# EAGLE design OMHGW_3_2 (EAGLE 5.11)
VERSION: OMHGM_3_2

## Sheet 1 of 3
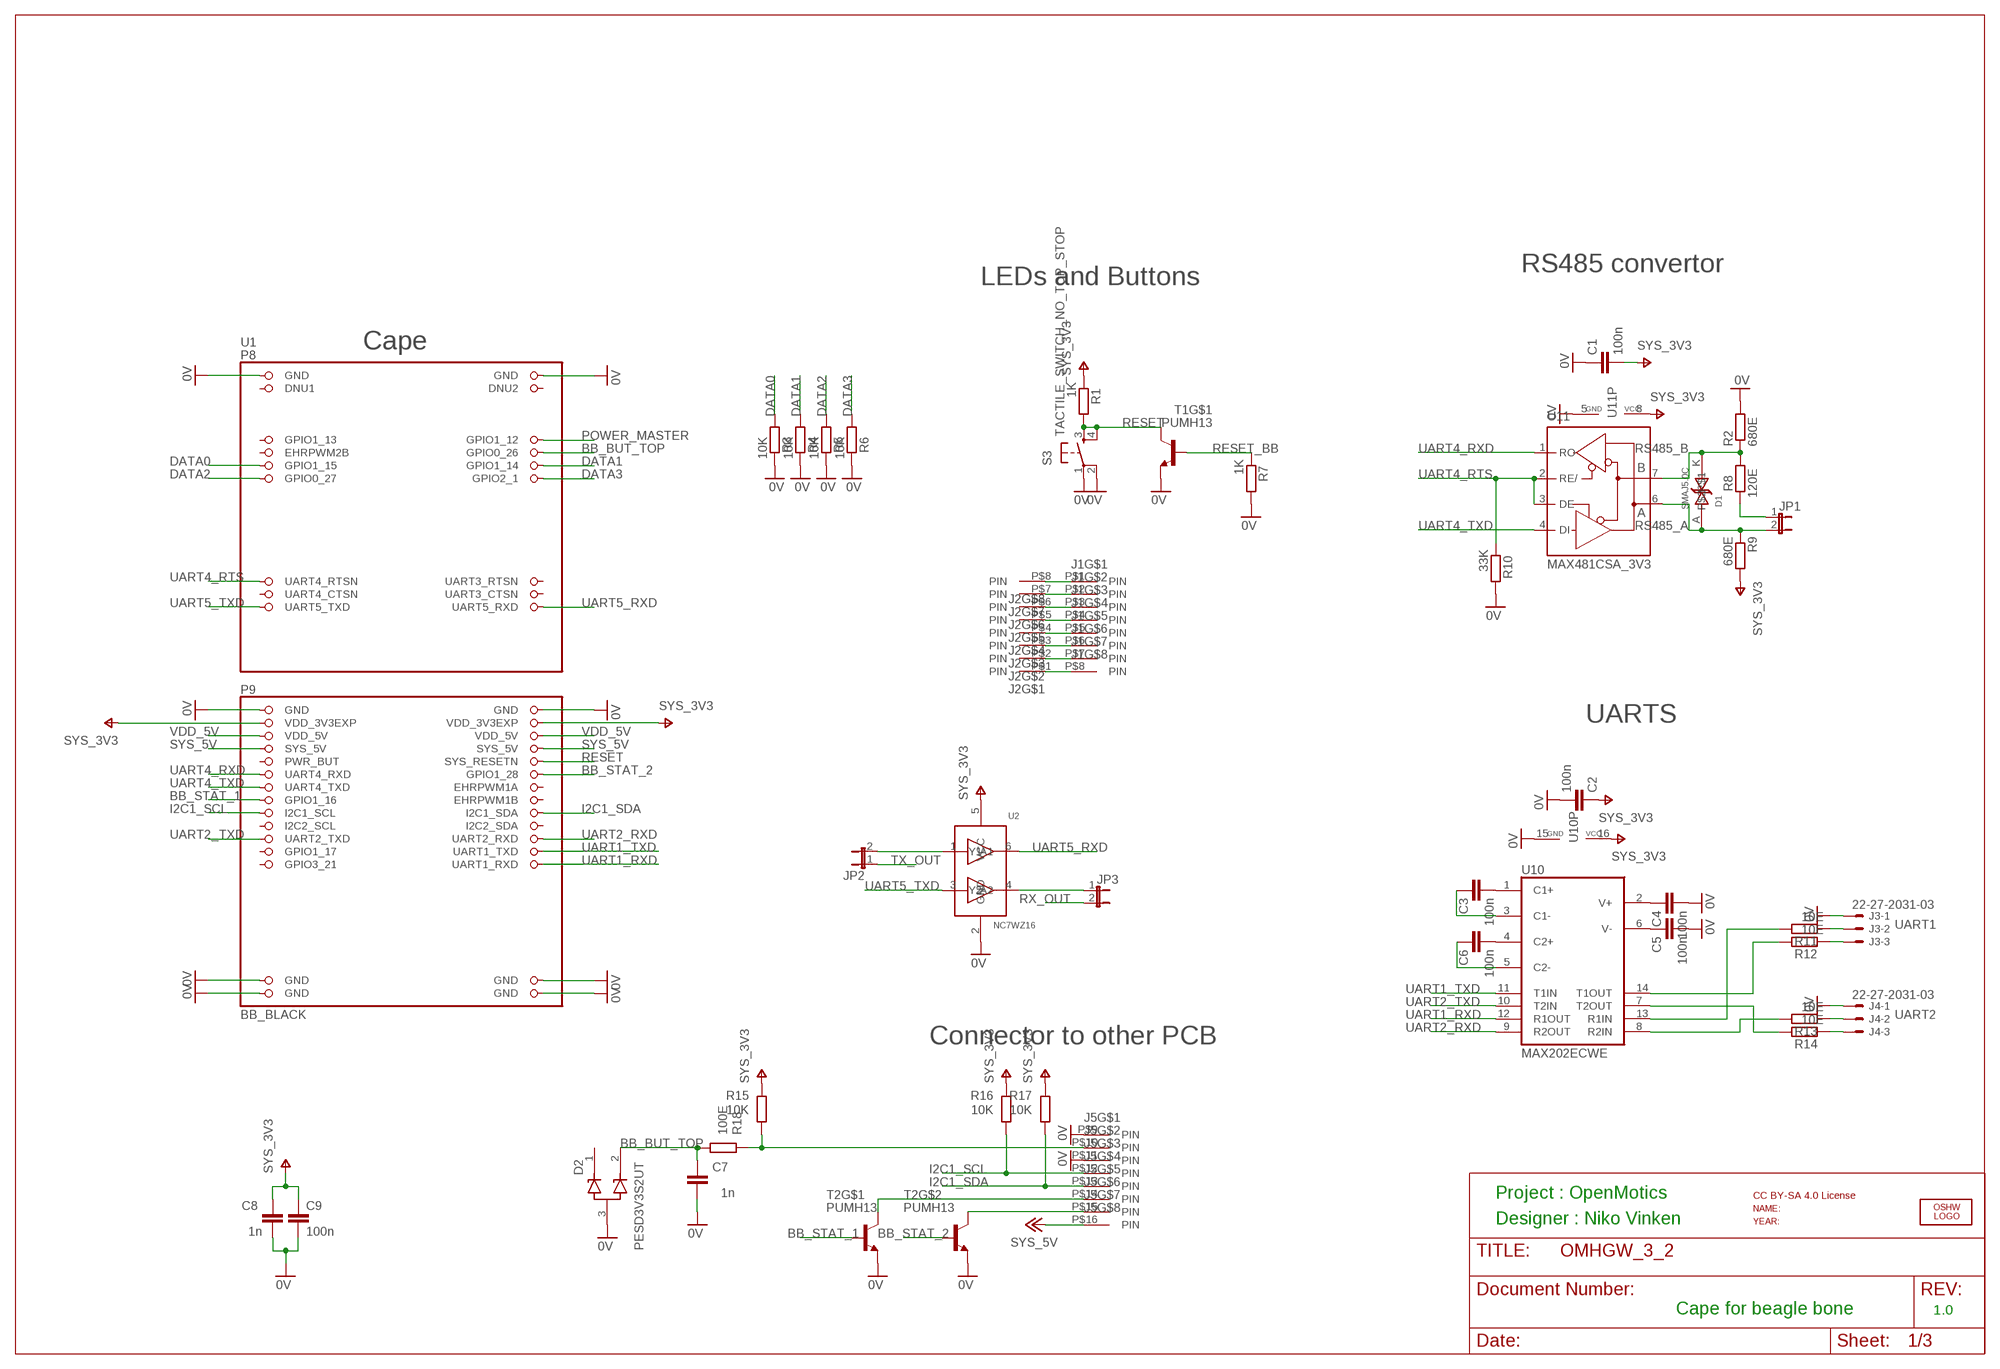
[diagram p0: schematic, sheet 1]

### Parts
C1  100n  C-EUC0603  [C0603]
C2  100n  C-EUC0603  [C0603]
C3  100n  C-EUC0603  [C0603]
C4  100n  C-EUC0603  [C0603]
C5  100n  C-EUC0603  [C0603]
C6  100n  C-EUC0603  [C0603]
C7  1n  C-EUC0603  [C0603]
C8  1n  C-EUC0603  [C0603]
C9  100n  C-EUC0603  [C0603]
D1  SMAJ5.0C  [DO-214AC(SMA)]
D2  PESD3V3S2UT  PESD3V3S2UAT  [SOT23]
J1  TM23_RJ45  [TM23_RJ45]
J2  98414-G06-08ULF  [98414-G06-08ULF]
J3  22-27-2031-03  [6410-03]
J4  22-27-2031-03  [6410-03]
J5  8PIN_CON_AMPSMD  [8PIN_CON_AMP_SMD]
JP1  JP1E  [JP1]
JP2  JP1E  [JP1]
JP3  JP1E  [JP1]
LOGO2  OSHW_LOGO_FILLX0150-NT  [OSHW_FILLX150_NOTEXT]
R1  1K  R-EU_R0603  [R0603]
R2  680E  R-EU_R0603  [R0603]
R3  10K  R-EU_R0603  [R0603]
R4  10K  R-EU_R0603  [R0603]
R5  10K  R-EU_R0603  [R0603]
R6  10K  R-EU_R0603  [R0603]
R7  1K  R-EU_R0603  [R0603]
R8  120E  R-EU_R0603  [R0603]
R9  680E  R-EU_R0603  [R0603]
R10  33K  R-EU_R0603  [R0603]
R11  10E  R-EU_R0603  [R0603]
R12  10E  R-EU_R0603  [R0603]
R13  10E  R-EU_R0603  [R0603]
R14  10E  R-EU_R0603  [R0603]
R15  10K  R-EU_R0603  [R0603]
R16  10K  R-EU_R0603  [R0603]
R17  10K  R-EU_R0603  [R0603]
R18  100E  R-EU_R0603  [R0603]
S3  TACTILE_SWITCH_NO_TOP_STOP  [B3F_10XX]
T1  PUMH13  [SOT363]
T2  PUMH13  [SOT363]
U1  BB_BLACK  [BB_BLACK_PINS]
U2  NC7WZ16  [SC70_6P]
U10  MAX202ECWE  [SOIC18]
U11  MAX481CSA_3V3  MAX481CSA  [SO08]
U$5  CC_BY_SA  [CC_BY_SA]

### Nets
0V: C1.1 C2.2 C4.2 C5.2 C7.1 C8.2 C9.2 D2.3 J3.1 J4.1 J5.P$9 J5.P$11 R2.2 R3.1 R4.1 R5.1 R6.1 R7.2 R10.2 S3.1(P) S3.2(P1) T1.1(E) T2.1(E) T2.4(E) U1.P$1(GND) U1.P$2(GND) U1.P$43(GND) U1.P$44(GND) U1.P$45(GND) U1.P$46(GND) U1.P$47(GND) U1.P$48(GND) U2.2(GND) U10.15(GND) U11.5(GND) ; also sheet 2,3
BB_BUT_TOP: C7.2 D2.2 R18.1 U1.P$60(GPIO0_26)
BB_STAT_1: T2.2(B) U1.P$15(GPIO1_16)
BB_STAT_2: T2.5(B) U1.P$12(GPIO1_28)
DATA0: R3.2 U1.P$61(GPIO1_15) ; also sheet 2
DATA1: R4.2 U1.P$62(GPIO1_14) ; also sheet 2
DATA2: R5.2 U1.P$63(GPIO0_27) ; also sheet 2
DATA3: R6.2 U1.P$64(GPIO2_1) ; also sheet 2
I2C1_SCL: J5.P$12 R16.1 U1.P$17(I2C1_SCL)
I2C1_SDA: J5.P$13 R17.1 U1.P$18(I2C1_SDA)
N$1: J1.P$8 J2.P$1
N$2: C3.1 U10.3(C1-)
N$4: JP1.1 R8.1
N$7: J1.P$7 J2.P$2
N$12: J5.P$10 R15.1 R18.2
N$13: J1.P$6 J2.P$3
N$14: J1.P$5 J2.P$4
N$15: J1.P$4 J2.P$5
N$16: C4.1 U10.2(V+)
N$17: C5.1 U10.6(V-)
N$18: C3.2 U10.1(C1+)
N$19: J3.2 R11.1
N$20: J1.P$3 J2.P$6
N$21: C6.2 U10.4(C2+)
N$22: J1.P$2 J2.P$7
N$23: C6.1 U10.5(C2-)
N$24: J3.3 R12.1
N$25: J4.2 R13.1
N$26: J1.P$1 J2.P$8
N$27: J4.3 R14.1
N$29: J5.P$14 T2.6(C)
N$30: J5.P$15 T2.3(C)
N$35: JP2.2 U2.1(A1)
N$36: JP3.1 U2.4(Y2)
N$39: R13.2 U10.8(R2IN)
N$40: R14.2 U10.7(T2OUT)
N$41: R11.2 U10.13(R1IN)
N$42: R12.2 U10.14(T1OUT)
POWER_MASTER: U1.P$58(GPIO1_12) ; also sheet 3
RESET: R1.2 S3.3(S) S3.4(S1) T1.6(C) U1.P$10(SYS_RESETN)
RESET_BB: R7.1 T1.2(B) ; also sheet 2
RS485_A: D1.A JP1.2 R9.1 U11.6(A) ; also sheet 3
RS485_B: D1.K R2.1 R8.2 U11.7(B) ; also sheet 3
RX_OUT: JP3.2 ; also sheet 2
SYS_5V: J5.P$16 U1.P$7(SYS_5V) U1.P$8(SYS_5V)
TX_OUT: JP2.1 ; also sheet 2
UART1_RXD: U1.P$26(UART1_RXD) U10.12(R1OUT)
UART1_TXD: U1.P$24(UART1_TXD) U10.11(T1IN)
UART2_RXD: U1.P$22(UART2_RXD) U10.9(R2OUT)
UART2_TXD: U1.P$21(UART2_TXD) U10.10(T2IN)
UART4_RTS: R10.1 U1.P$79(UART4_RTSN) U11.2(RE/) U11.3(DE)
UART4_RXD: U1.P$11(UART4_RXD) U11.1(RO) ; also sheet 2
UART4_TXD: U1.P$13(UART4_TXD) U11.4(DI) ; also sheet 2
UART5_RXD: U1.P$84(UART5_RXD) U2.6(Y1)
UART5_TXD: U1.P$83(UART5_TXD) U2.3(A2)
V+: C1.2 C2.1 C8.1 C9.1 R1.1 R9.2 R15.2 R16.2 R17.2 U1.P$3(VDD_3V3EXP) U1.P$4(VDD_3V3EXP) U2.5(VCC) U10.16(VCC) U11.8(VCC) ; supply symbol labelled SYS_3V3 ; also sheet 3
VDD_5V: U1.P$5(VDD_5V) U1.P$6(VDD_5V) ; also sheet 3
Unconnected: D2.1 U1.P$9(PWR_BUT) U1.P$14(EHRPWM1A) U1.P$16(EHRPWM1B) U1.P$19(I2C2_SCL) U1.P$20(I2C2_SDA) U1.P$23(GPIO1_17) U1.P$25(GPIO3_21) U1.P$57(GPIO1_13) U1.P$59(EHRPWM2B) U1.P$80(UART3_RTSN) U1.P$81(UART4_CTSN) U1.P$82(UART3_CTSN)

### Notes on the sheet
- RS485 convertor
- LEDs and Buttons
- Cape
- UARTS
- UART1
- UART2
- Connector to other PCB
- Project : OpenMotics
- Designer : Niko Vinken
- Cape for beagle bone | 1.0

## Sheet 2 of 3
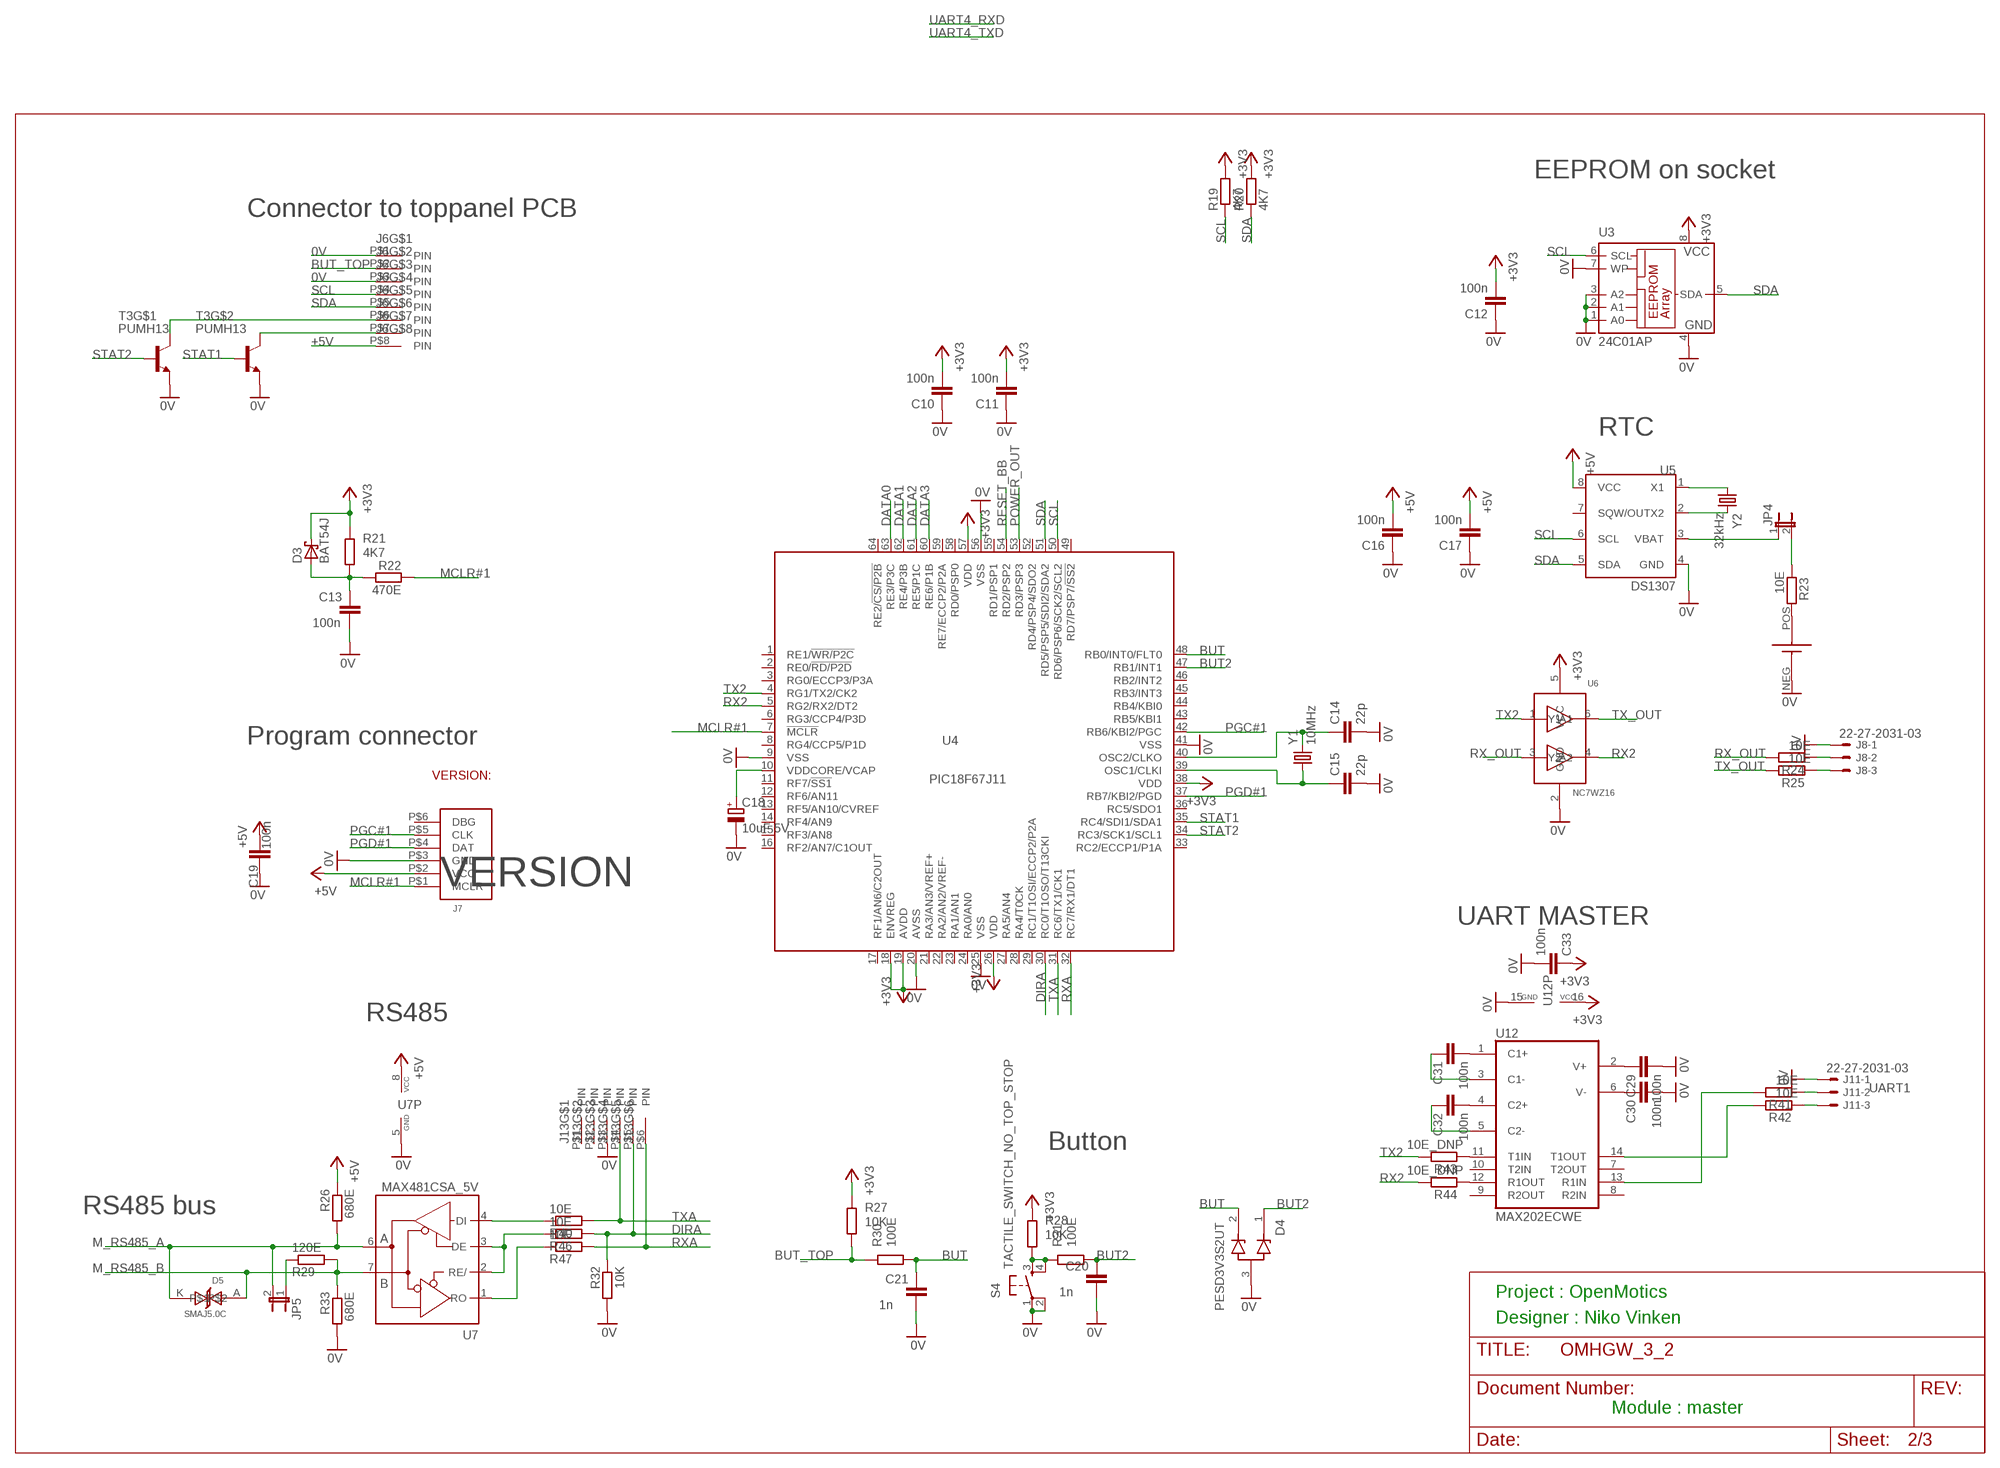
[diagram p1: schematic, sheet 2]

### Parts
B1  BATTERY_BH32T-C-ND  BATTERY_KINGSTON_1065BH32T-C  [BH32T-C]
C10  100n  C-EUC0603  [C0603]
C11  100n  C-EUC0603  [C0603]
C12  100n  C-EUC0603  [C0603]
C13  100n  C-EUC0603  [C0603]
C14  22p  C-EUC0603  [C0603]
C15  22p  C-EUC0603  [C0603]
C16  100n  C-EUC0603  [C0603]
C17  100n  C-EUC0603  [C0603]
C18  10uF 5V  CPOL-EUA3216-18W  [A3216-18W]
C19  100n  C-EUC0603  [C0603]
C20  1n  C-EUC0603  [C0603]
C21  1n  C-EUC0603  [C0603]
C29  100n  C-EUC0603  [C0603]
C30  100n  C-EUC0603  [C0603]
C31  100n  C-EUC0603  [C0603]
C32  100n  C-EUC0603  [C0603]
C33  100n  C-EUC0603  [C0603]
D3  BAT54J  [SOD323_REFLOW]
D4  PESD3V3S2UT  PESD3V3S2UAT  [SOT23]
D5  SMAJ5.0C  [DO-214AC(SMA)]
J6  8PIN_CON_AMP  [8PIN_CON_AMP]
J7  PROG_CON  [PROG_CON_WITH_VERSION]
J8  22-27-2031-03  [6410-03]
J11  22-27-2031-03  [6410-03]
J13  6PIN_CON_AMP  [6PIN_CON_AMP]
JP4  JP1E  [JP1]
JP5  JP1E  [JP1]
R19  4K7  R-EU_R0603  [R0603]
R20  4K7  R-EU_R0603  [R0603]
R21  4K7  R-EU_R0603  [R0603]
R22  470E  R-EU_R0603  [R0603]
R23  10E  R-EU_R0603  [R0603]
R24  10E  R-EU_R0603  [R0603]
R25  10E  R-EU_R0603  [R0603]
R26  680E  R-EU_R0603  [R0603]
R27  10K  R-EU_R0603  [R0603]
R28  10K  R-EU_R0603  [R0603]
R29  120E  R-EU_R0603  [R0603]
R30  100E  R-EU_R0603  [R0603]
R31  100E  R-EU_R0603  [R0603]
R32  10K  R-EU_R0603  [R0603]
R33  680E  R-EU_R0603  [R0603]
R40  10E  R-EU_R0603  [R0603]
R41  10E  R-EU_R0603  [R0603]
R42  10E  R-EU_R0603  [R0603]
R43  10E_DNP  R-EU_R0603  [R0603]
R44  10E_DNP  R-EU_R0603  [R0603]
R46  10E  R-EU_R0603  [R0603]
R47  10E  R-EU_R0603  [R0603]
S4  TACTILE_SWITCH_NO_TOP_STOP  [B3F_10XX]
T3  PUMH13  [SOT363]
U3  24C01AP  [DIL8]
U4  PIC18F67J11  PIC18F65J10  [TQFP64-10X10]
U5  DS1307  [SOIC-8]
U6  NC7WZ16  [SC70_6P]
U7  MAX481CSA_5V  MAX481CSA  [SO08]
U12  MAX202ECWE  [SOIC18]
Y1  10MHz  CRYSTALSM49  [SM49]
Y2  32kHz  CRYSTALMM20SS  [MM20SS]

### Nets
0V: B1.NEG C10.1 C11.1 C12.1 C13.1 C14.2 C15.2 C16.1 C17.1 C18.- C19.2 C20.1 C21.1 C29.2 C30.2 C33.2 D4.3 J6.P$1 J6.P$3 J7.P$3(GND) J8.1 J11.1 J13.P$3 R32.2 R33.2 S4.1(P) S4.2(P1) T3.1(E) T3.4(E) U3.1(A0) U3.2(A1) U3.3(A2) U3.4(GND) U3.7(WP) U4.9(VSS) U4.20(AVSS) U4.25(VSS) U4.41(VSS) U4.56(VSS) U5.4(GND) U6.2(GND) U7.5(GND) U12.15(GND) ; also sheet 1,3
+3V3: C10.2 C11.2 C12.2 C33.1 D3.1 R19.2 R20.2 R21.2 R27.2 R28.2 U3.8(VCC) U4.18(ENVREG) U4.19(AVDD) U4.26(VDD) U4.38(VDD) U4.57(VDD) U6.5(VCC) U12.16(VCC) ; also sheet 3
+5V: C16.2 C17.2 C19.1 J6.P$8 J7.P$2(VCC) R26.1 U5.8(VCC) U7.8(VCC) ; also sheet 3
BUT: C21.2 D4.2 R30.1 U4.48(RB0/INT0/FLT0)
BUT2: C20.2 D4.1 R31.1 U4.47(RB1/INT1)
BUT3: R28.1 R31.2 S4.3(S) S4.4(S1)
BUT_TOP: J6.P$2 R27.1 R30.2
DATA0: U4.63(RE3/P3C) ; also sheet 1
DATA1: U4.62(RE4/P3B) ; also sheet 1
DATA2: U4.61(RE5/P1C) ; also sheet 1
DATA3: U4.60(RE6/P1B) ; also sheet 1
DIRA: J13.P$5 R32.1 R46.2 U4.30(RC0/T1OSO/T13CKI)
M_RS485_A: D5.K JP5.2 R26.2 U7.6(A) ; also sheet 3
M_RS485_B: D5.A R29.2 R33.1 U7.7(B) ; also sheet 3
MCLR#1: J7.P$1(MCLR) R22.1 U4.7(!MCLR)
N$5: U5.1(X1) Y2.1
N$8: U5.2(X2) Y2.4
N$9: JP4.1 U5.3(VBAT)
N$10: JP4.2 R23.1
N$11: B1.POS R23.2
N$31: J8.2 R24.1
N$32: J8.3 R25.1
N$33: J6.P$6 T3.6(C)
N$34: J6.P$7 T3.3(C)
N$43: C31.1 U12.3(C1-)
N$44: C32.1 U12.5(C2-)
N$45: C29.1 U12.2(V+)
N$46: C30.1 U12.6(V-)
N$47: C31.2 U12.1(C1+)
N$48: C32.2 U12.4(C2+)
N$49: JP5.1 R29.1
N$50: J11.2 R41.1
N$51: J11.3 R42.1
N$52: R43.1 U12.11(T1IN)
N$53: R44.1 U12.12(R1OUT)
N$55: R40.1 U7.4(DI)
N$56: R41.2 U12.13(R1IN)
N$57: R42.2 U12.14(T1OUT)
N$60: R46.1 U7.2(RE/) U7.3(DE)
N$61: R47.1 U7.1(RO)
N$62: C15.1 U4.39(OSC1/CLKI) Y1.1
N$63: C14.1 U4.40(OSC2/CLKO) Y1.2
N$444: C13.2 D3.2 R21.1 R22.2
PGC#1: J7.P$5(CLK) U4.42(RB6/KBI2/PGC)
PGD#1: J7.P$4(DAT) U4.37(RB7/KBI2/PGD)
POWER_OUT: U4.53(RD3/PSP3) ; also sheet 3
RESET_BB: U4.54(RD2/PSP2) ; also sheet 1
RX2: R44.2 U4.5(RG2/RX2/DT2) U6.4(Y2)
RX_OUT: R24.2 U6.3(A2) ; also sheet 1
RXA: J13.P$6 R47.2 U4.32(RC7/RX1/DT1)
SCL: J6.P$4 R19.1 U3.6(SCL) U4.50(RD6/PSP6/SCK2/SCL2) U5.6(SCL)
SDA: J6.P$5 R20.1 U3.5(SDA) U4.51(RD5/PSP5/SDI2/SDA2) U5.5(SDA)
STAT1: T3.5(B) U4.35(RC4/SDI1/SDA1)
STAT2: T3.2(B) U4.34(RC3/SCK1/SCL1)
TX2: R43.2 U4.4(RG1/TX2/CK2) U6.1(A1)
TX_OUT: R25.2 U6.6(Y1) ; also sheet 1
TXA: J13.P$4 R40.2 U4.31(RC6/TX1/CK1)
VCAP: C18.+ U4.10(VDDCORE/VCAP)
Unconnected: J7.P$6(DBG) J13.P$1 J13.P$2 U4.1(RE1/!WR/P2C) U4.2(RE0/!RD/P2D) U4.3(RG0/ECCP3/P3A) U4.6(RG3/CCP4/P3D) U4.8(RG4/CCP5/P1D) U4.11(RF7/!SS1) U4.12(RF6/AN11) U4.13(RF5/AN10/CVREF) U4.14(RF4/AN9) U4.15(RF3/AN8) U4.16(RF2/AN7/C1OUT) U4.17(RF1/AN6/C2OUT) U4.21(RA3/AN3/VREF+) U4.22(RA2/AN2/VREF-) U4.23(RA1/AN1) U4.24(RA0/AN0) U4.27(RA5/AN4) U4.28(RA4/T0CK) U4.29(RC1/T1OSI/ECCP2/P2A) U4.33(RC2/ECCP1/P1A) U4.36(RC5/SDO1) U4.43(RB5/KBI1) U4.44(RB4/KBI0) U4.45(RB3/INT3) U4.46(RB2/INT2) U4.49(RD7/PSP7/!SS2) U4.52(RD4/PSP4/SDO2) U4.55(RD1/PSP1) U4.58(RD0/PSP0) U4.59(RE7/ECCP2/P2A) U4.64(RE2/!CS/P2B) U5.7(SQW/OUT) U12.7(T2OUT) U12.8(R2IN) U12.9(R2OUT) U12.10(T2IN)

### Notes on the sheet
- EEPROM on socket
- Connector to toppanel PCB
- RTC
- Program connector
- UART MASTER
- RS485
- UART1
- Button
- RS485 bus
- Project : OpenMotics
- Designer : Niko Vinken
- Module : master

## Sheet 3 of 3
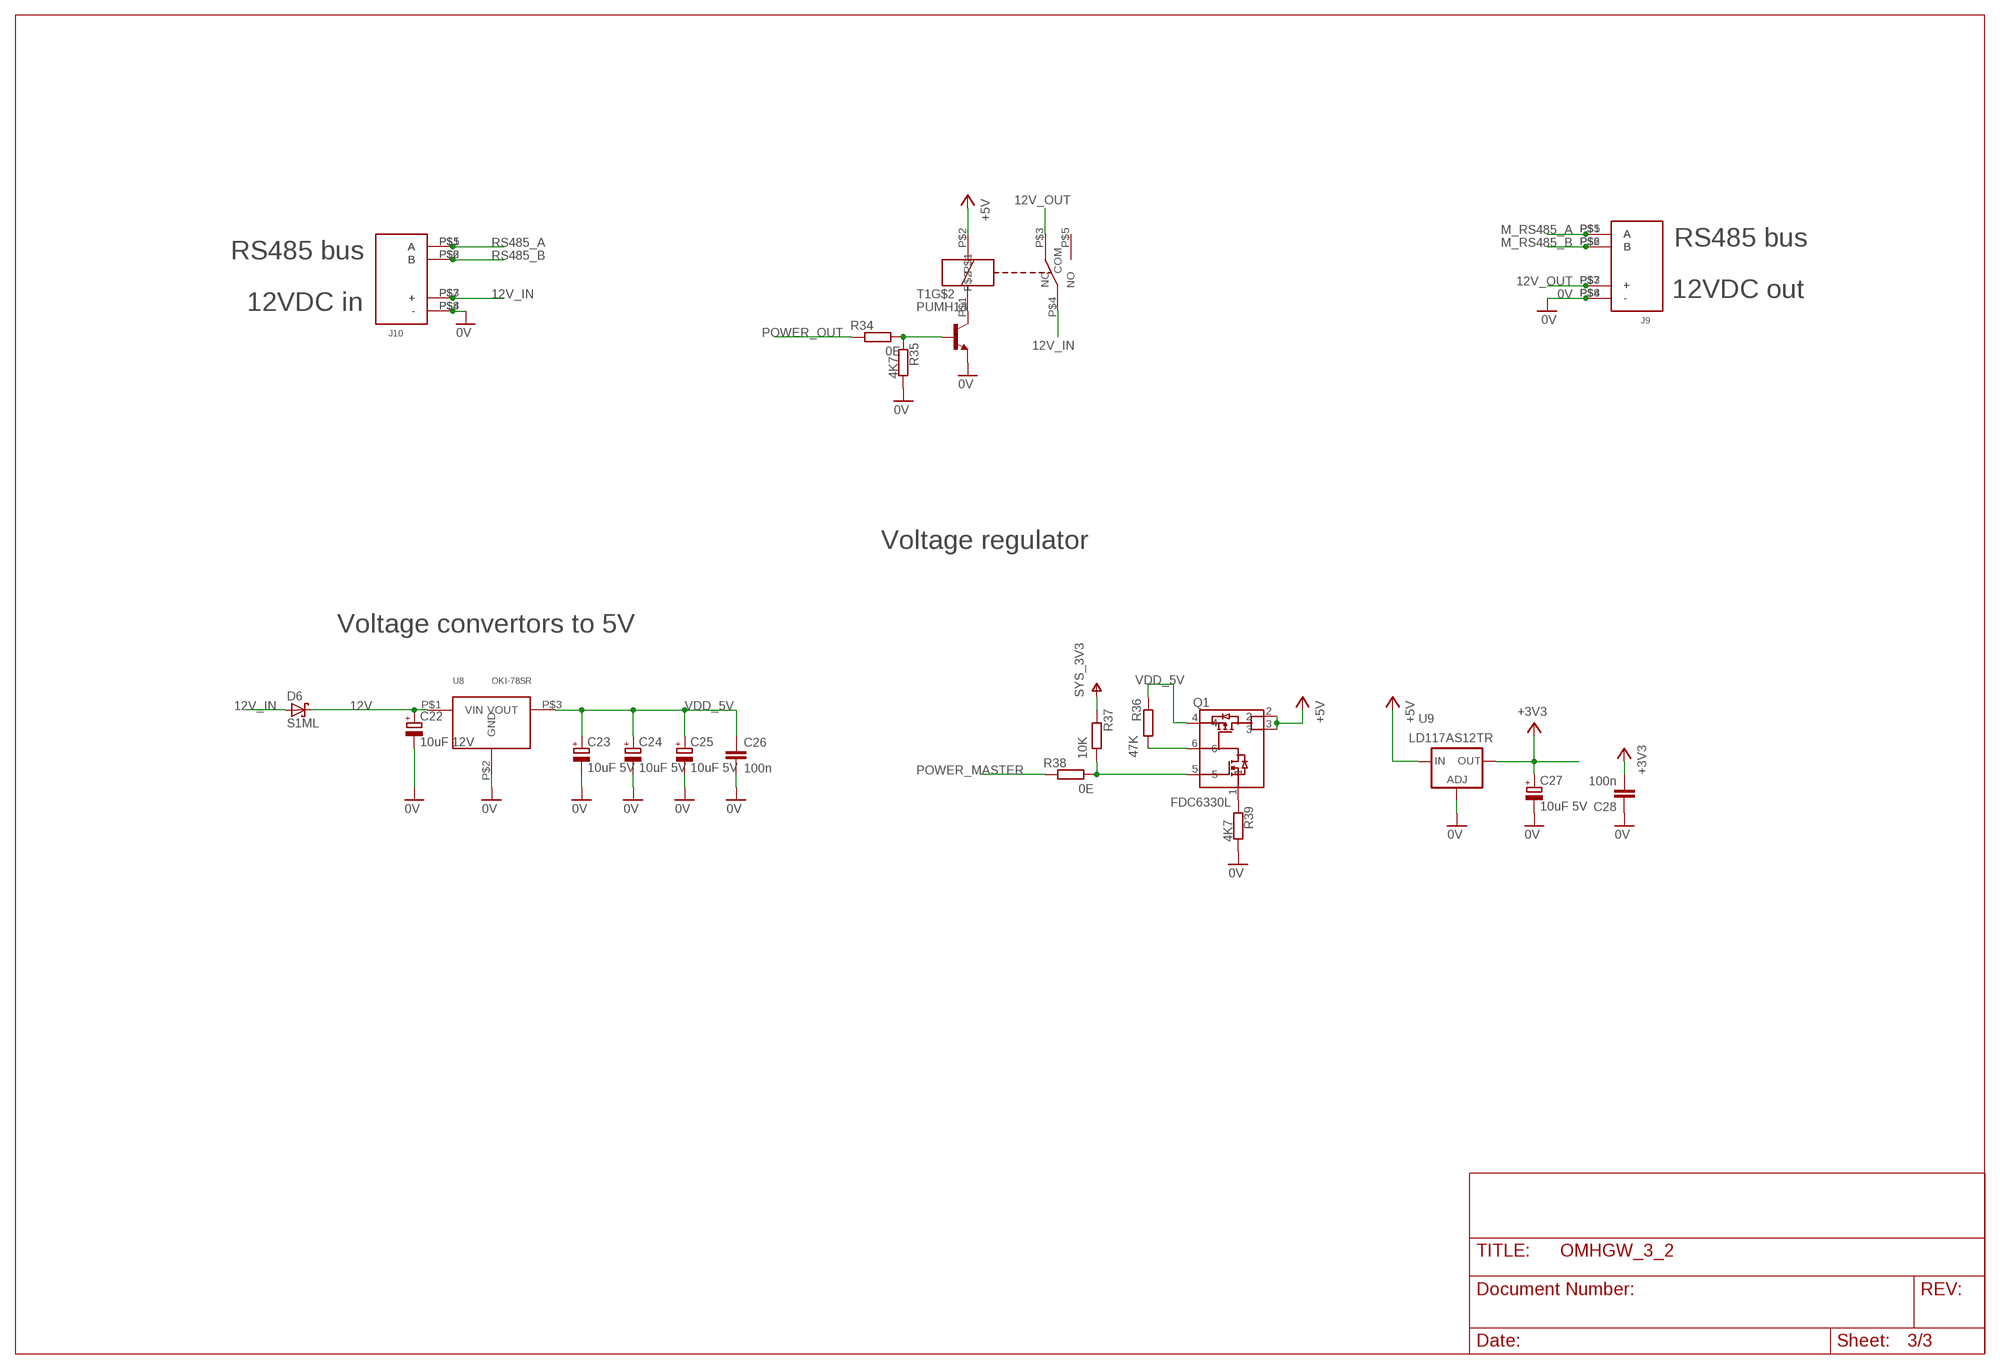
[diagram p2: schematic, sheet 3]

### Parts
C22  10uF 12V  CPOL-EUA3216-18W  [A3216-18W]
C23  10uF 5V  CPOL-EUA3216-18W  [A3216-18W]
C24  10uF 5V  CPOL-EUA3216-18W  [A3216-18W]
C25  10uF 5V  CPOL-EUA3216-18W  [A3216-18W]
C26  100n  C-EUC0603  [C0603]
C27  10uF 5V  CPOL-EUA3216-18W  [A3216-18W]
C28  100n  C-EUC0603  [C0603]
D6  S1ML  SMF5.0AT1  [SOD123FL]
J9  PTDA_1.5_4-PH_5.0  [PTDA_1.5_X-PH_5.0]
J10  PTDA_1.5_4-PH_5.0  [PTDA_1.5_X-PH_5.0]
K1  FTR_LY  [FTR-LY_RIGHT_ANGLE]
Q1  FDC6330L  [SOT23_6]
R34  0E  R-EU_R0603  [R0603]
R35  4K7  R-EU_R0603  [R0603]
R36  47K  R-EU_R0603  [R0603]
R37  10K  R-EU_R0603  [R0603]
R38  0E  R-EU_R0603  [R0603]
R39  4K7  R-EU_R0603  [R0603]
U8  OKI-78SR  [OKI-78SR]
U9  LD117AS12TR  [SOT223]

### Nets
0V: C22.- C23.- C24.- C25.- C26.2 C27.- C28.1 J9.P$4(-) J9.P$8(-) J10.P$4(-) J10.P$8(-) R35.2 R39.2 T1.4(E) U8.P$2(GND) U9.1(ADJ) ; also sheet 1,2
12V: C22.+ D6.C U8.P$1(VIN)
12V_IN: D6.A J10.P$3(+) J10.P$7(+) K1.P$4(COM)
12V_OUT: J9.P$3(+) J9.P$7(+) K1.P$3(NC)
+3V3: C27.+ C28.2 U9.4(OUT) ; also sheet 2
+5V: K1.P$2 Q1.2 Q1.3 U9.3(IN) ; also sheet 2
M_RS485_A: J9.P$1(A) J9.P$5(A) ; also sheet 2
M_RS485_B: J9.P$2(B) J9.P$6(B) ; also sheet 2
N$3: Q1.1 R39.1
N$6: Q1.6 R36.2
N$28: K1.P$1 T1.3(C)
N$37: R34.2 R35.1 T1.5(B)
N$38: Q1.5 R37.2 R38.2
POWER_MASTER: R38.1 ; also sheet 1
POWER_OUT: R34.1 ; also sheet 2
RS485_A: J10.P$1(A) J10.P$5(A) ; also sheet 1
RS485_B: J10.P$2(B) J10.P$6(B) ; also sheet 1
V+: R37.1 ; supply symbol labelled SYS_3V3 ; also sheet 1
VDD_5V: C23.+ C24.+ C25.+ C26.1 Q1.4 R36.1 U8.P$3(VOUT) ; also sheet 1
Unconnected: K1.P$5(NO)

### Notes on the sheet
- RS485 bus
- RS485 bus
- 12VDC out
- 12VDC in
- Voltage regulator
- Voltage convertors to 5V

## Power pins joined to a net without a drawn wire
DNU1: U1.P$49(DNU1)
DNU2: U1.P$50(DNU2)

## Library data of the parts
B1 = OpenMotics:BATTERY_KINGSTON_1065
C1-C17 C19-C21 C26 C28-C33 = resistor:C-EU: CAPACITOR, European symbol
C18 C22-C25 C27 = resistor:CPOL-EU: POLARIZED CAPACITOR, European symbol
D1 D5 = OpenMotics:SMAJ5.0C
D2 D4 = OpenMotics:PESD3V3S2UAT
D3 = OpenMotics:BAT54J
D6 = diode:SMF5.0AT1: 200 W Transient Voltage Suppressor Source: Data sheet <http://www.onsemi.com/pub_link/Collateral/SMF5.0AT1-D.PDF>
J1 = OpenMotics:TM23_RJ45
J2 = OpenMotics:98414-G06-08ULF
J3 J4 J8 J11 = con-molex:22-?-03: CONNECTOR wire to board 2.54 mm (.1 inch) pitch header; OC_FARNELL: unknown; OC_NEWARK: unknown
J5 J6 = OpenMotics:8PIN_CON_AMP
J7 = OpenMotics:PROG_CON
J9 J10 = OpenMotics:PTDA_1.5_4-PH_5.0
J13 = OpenMotics:6PIN_CON_AMP; VERSION: OMHXX_X_X
JP1-JP5 = jumper:JP1E: JUMPER
K1 = OpenMotics:FTR_LY
LOGO2 = ohw-logo:OSHW_LOGO_FILL
Q1 = OpenMotics:FDC6330L
R1 R3-R8 R10-R14 R23-R25 R41-R44 = rcl:R-EU_: RESISTOR, European symbol
R2 R9 R15-R22 R26-R40 R46 R47 = resistor:R-EU_: RESISTOR, European symbol
S3 S4 = OpenMotics:TACTILE_SWITCH_NO_TOP_STOP
T1-T3 = OpenMotics:PUMH13
U1 = OpenMotics:BB_BLACK
U2 U6 = OpenMotics:NC7WZ16
U3 = microchip:24C*: Serial EEPROM 1 K/2 K/4 K
U4 = microchip:PIC18F6*: PIC18F87J10 FAMILY 64/80-Pin, High-Performance, 1-Mbit Flash Microcontrollers with nanoWatt Technology Source: http://www.microchip.com/ .. 39663c.pdf
U5 = dallas:DS1307: I2C Serial RTC w/56 bytes battery backed RAM
U7 U11 = maxim:MAX481CSA: RS485 TRANSEIVER
U8 = OpenMotics:OKI-78SR
U9 = v-reg:LD117A?*: Low drop fixed and adjustable positive voltage regulators 1 A Source: http://www.st.com/stonline/products/literature/ds/7194/ld1117axx.pdf
U10 U12 = maxim:MAX202ECWE: RS232 TRANSEIVER
U$5 = OpenMotics:CC_BY_SA
Y1 Y2 = crystal:CRYSTAL: CRYSTAL

## Board
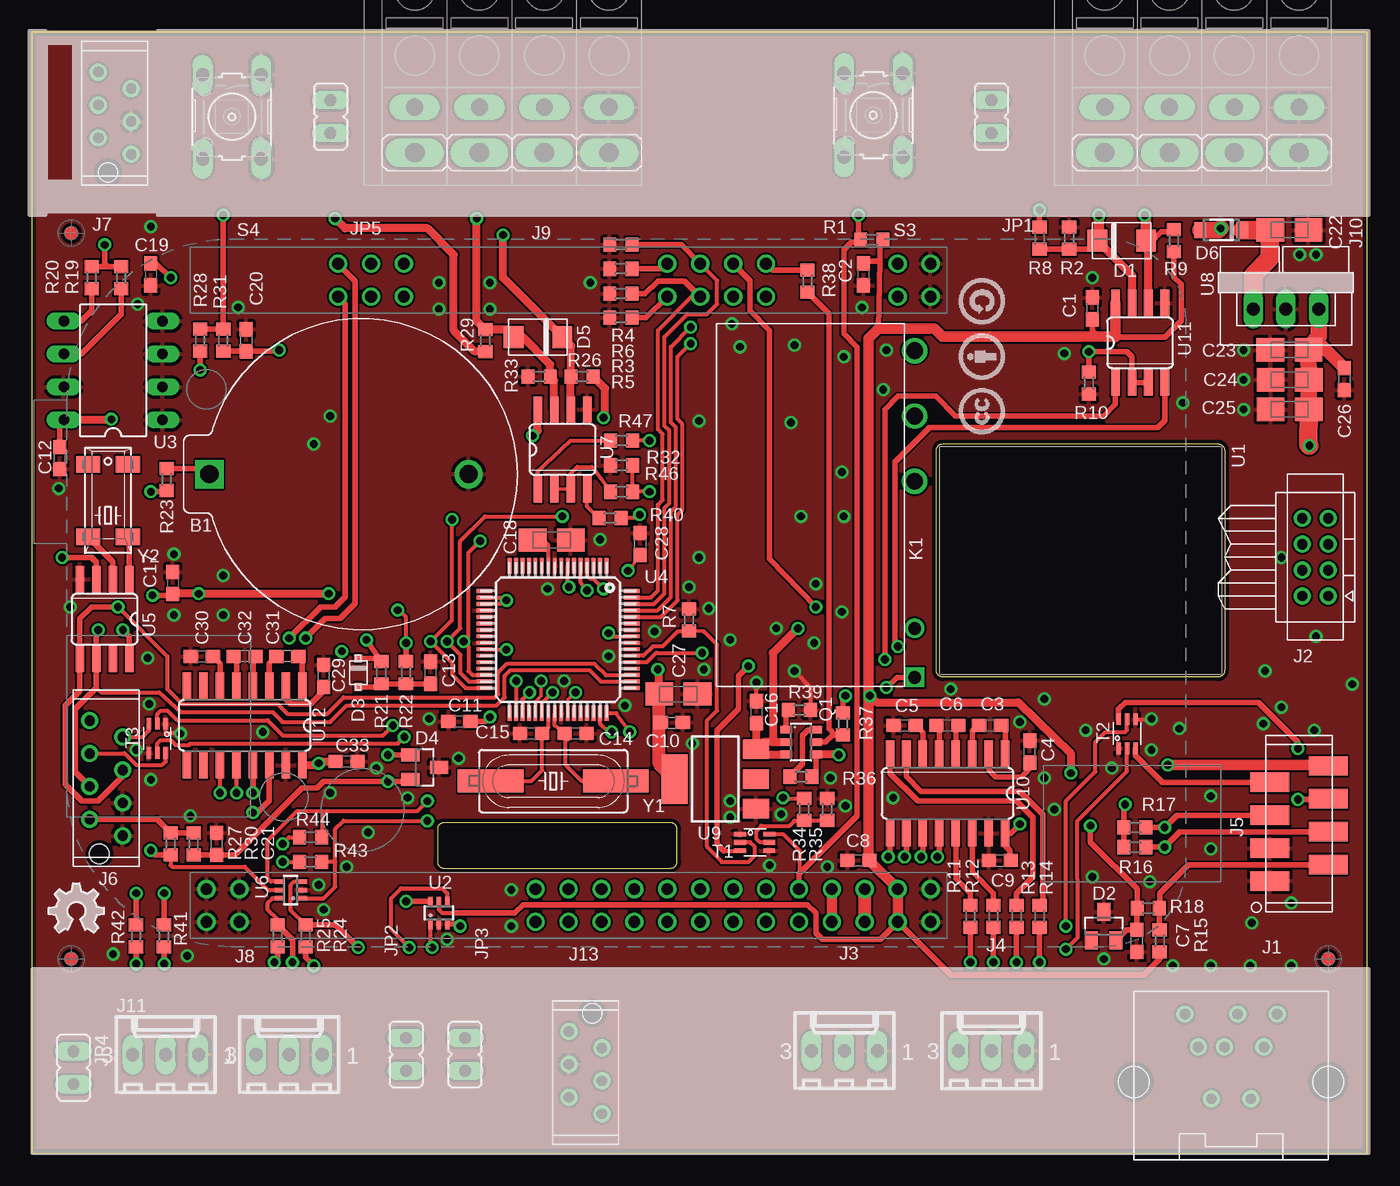
[diagram p3: board, top side]
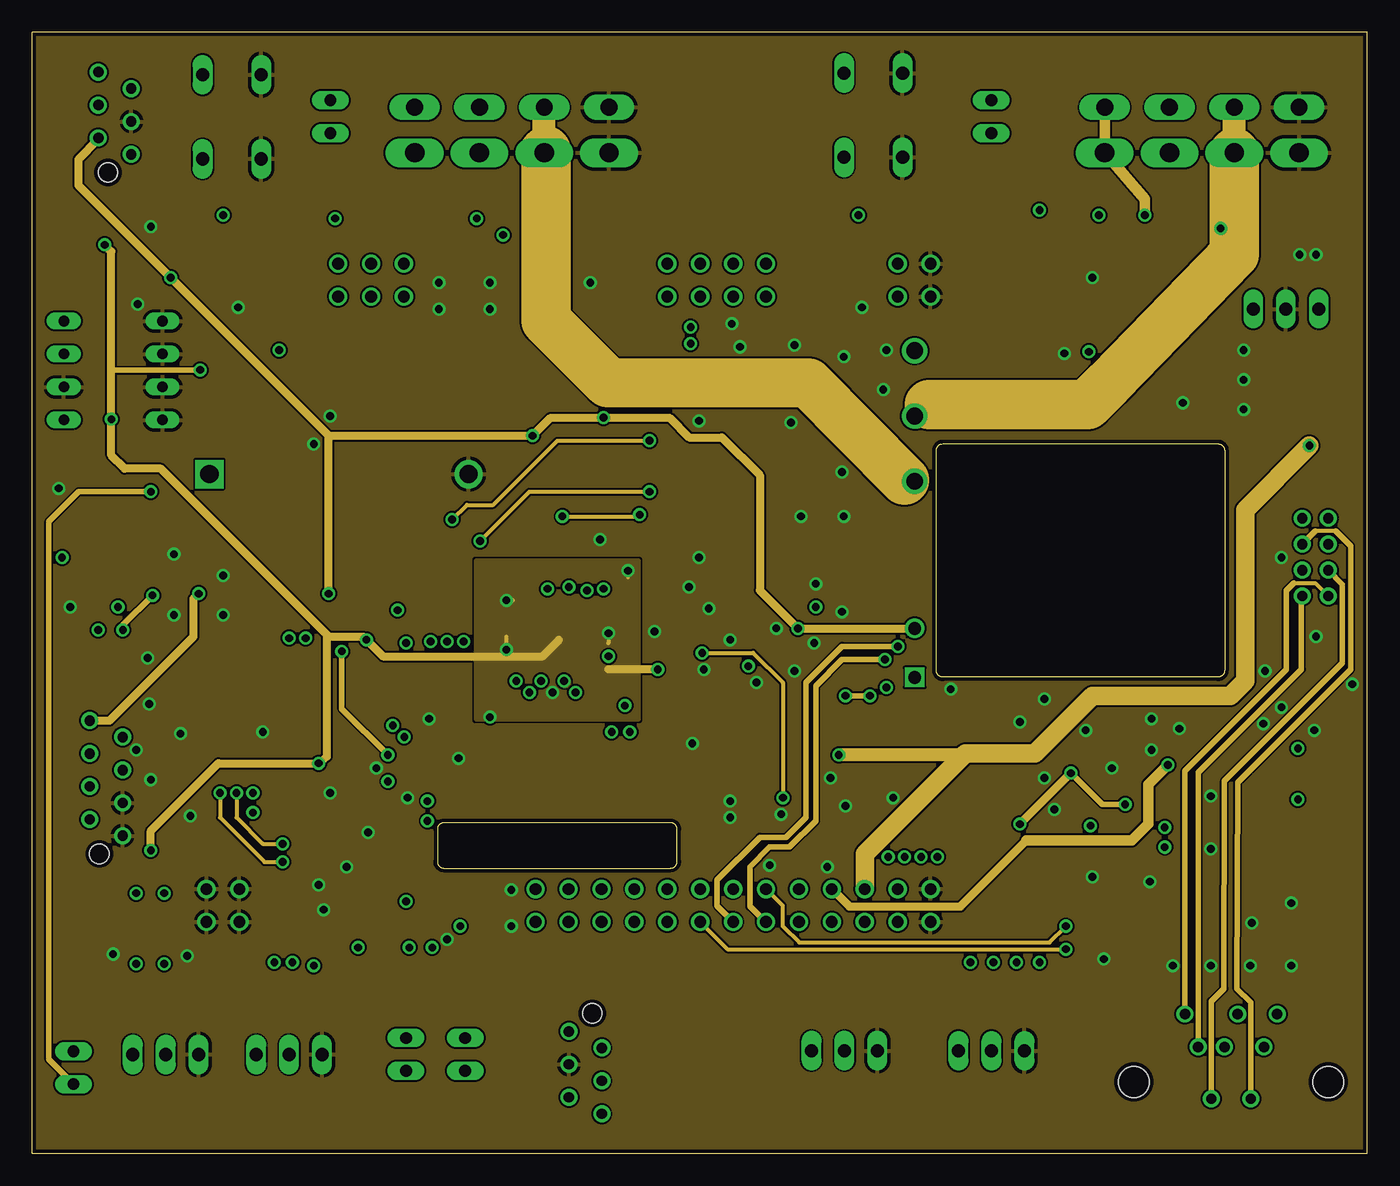
[diagram p4: board, inner layer VCC]
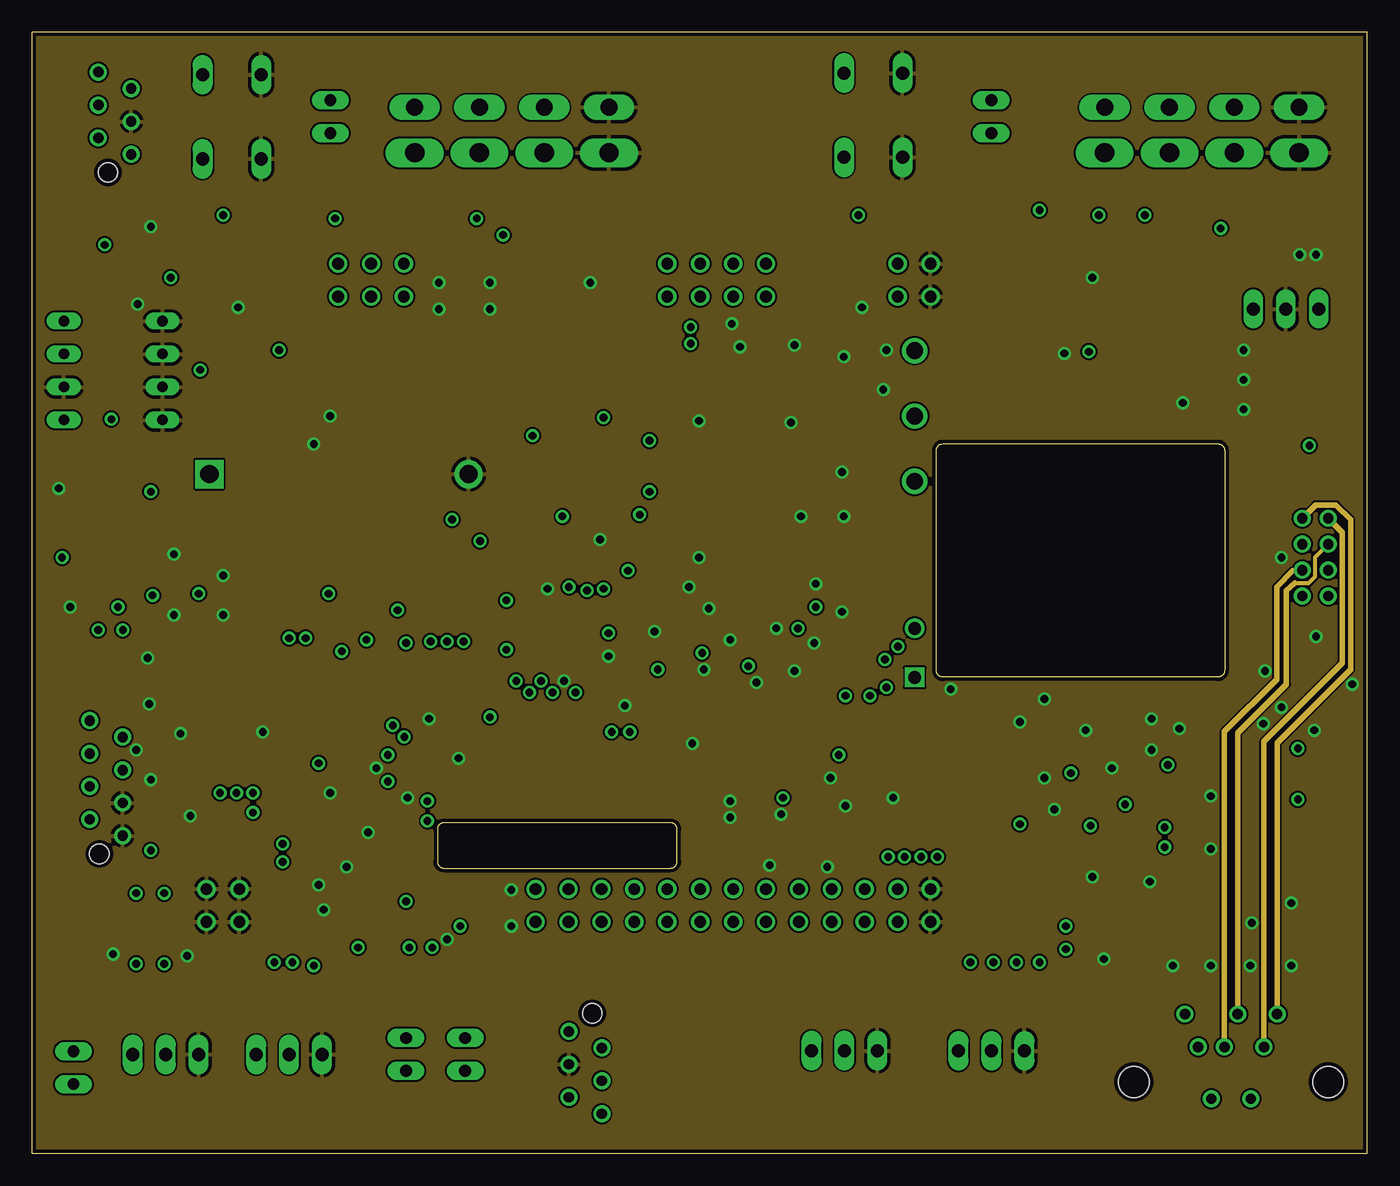
[diagram p5: board, inner layer Route15]
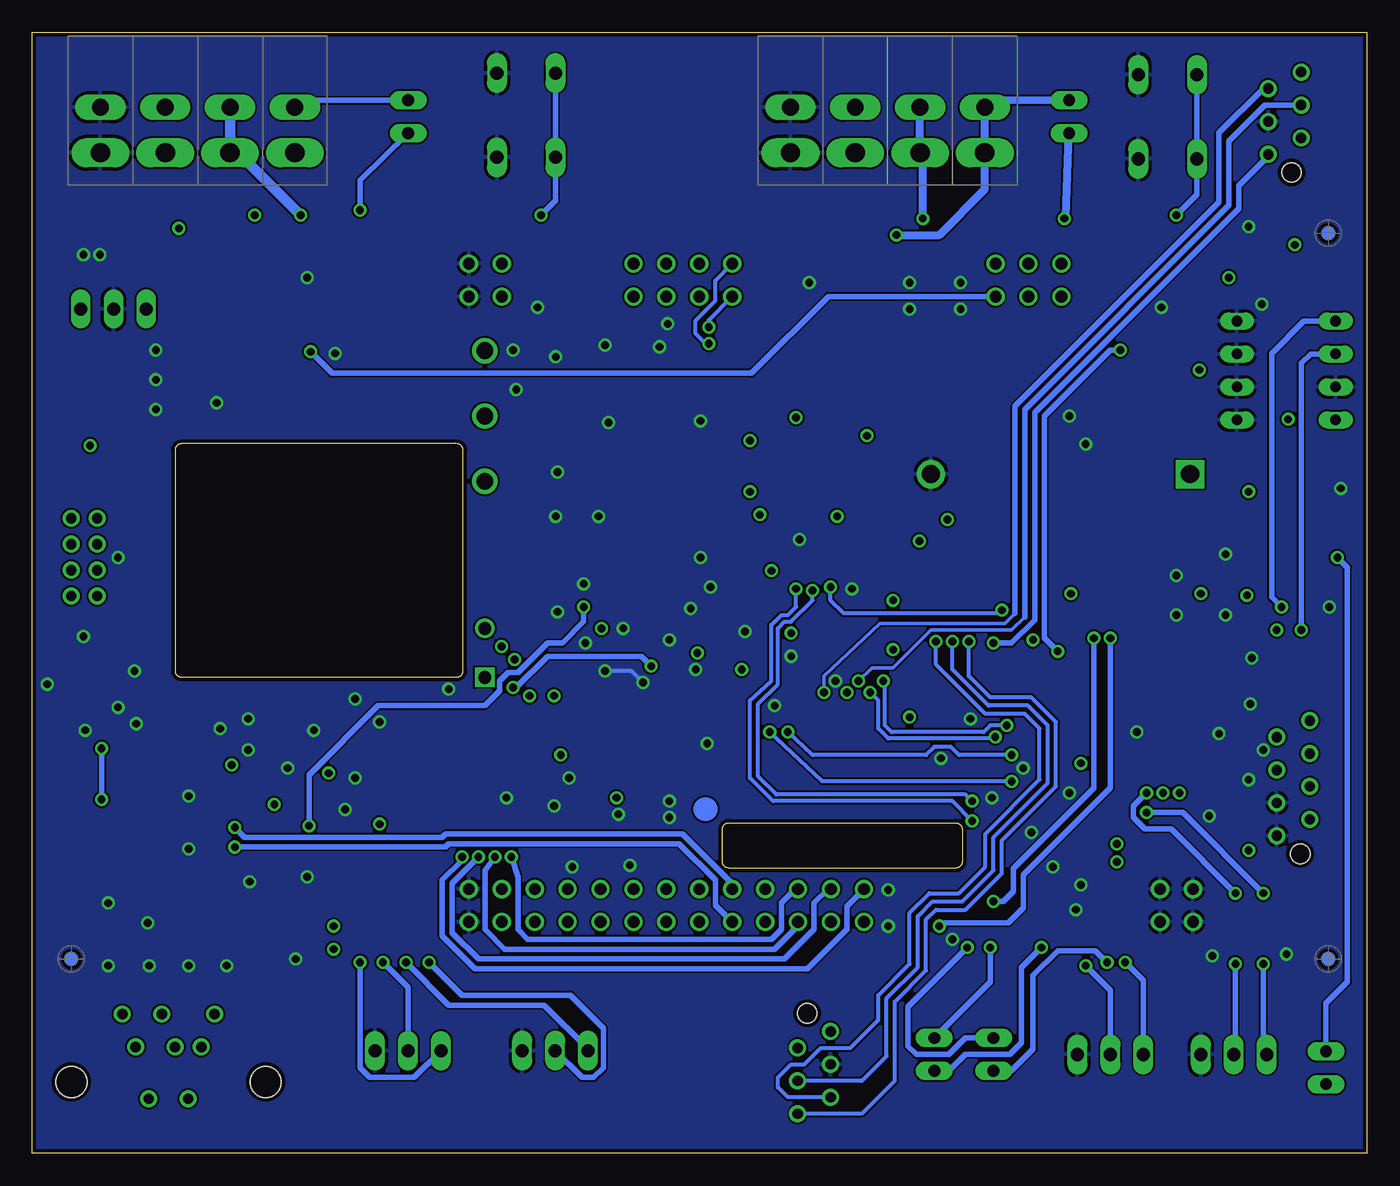
[diagram p6: board, bottom side, seen from below]

Size 103 x 86.5 mm. Coordinates in mm from the lower left corner, seen from the top.
Outline: 0,0 103,0 103,86.5 0,86.5 0,0
Copper layers (1+2+15+16): Top 0.035mm / dielectric 1.5mm / VCC 0.035mm / dielectric 0.15mm / Route15 0.035mm / dielectric 0.2mm / Bottom 0.035mm
Design rules "default *": minimum track width 10mil, minimum drill 24mil, track to track 6mil, track to pad 6mil, pad to pad 6mil, via to via 6mil, smd to smd 6mil, copper to edge 12mil, drill to drill 8mil, minimum pad ring 10mil, minimum via ring 8mil, stop-mask expansion 4mil, vias tented up to drill 0mil, thermal gap 10mil

### Footprints (pad centres in the part's own frame; a part is rotated, then mirrored left to right if it is on the bottom)
BH32T-C = drill 1.4 pad 2.184 round: NEG 20,0 | drill 1.4 pad 2.184 square: POS 0,0
C0603 = smd 1.1 x 1: 1 -0.85,0; 2 0.85,0
A3216-18W = smd 2.15 x 1.8: + 1.475,0; - -1.475,0
DO-214AC(SMA) = smd 1.524 x 1.676: A 3.759,0; K 0,0
SOT23 = smd 1 x 1.4: 1 -0.95,-1.1; 2 0.95,-1.1; 3 0,1.1
SOD323_REFLOW = smd 0.6 x 0.6: 1 1.1,0; 2 -1.1,0
SOD123FL = smd 0.91 x 1.22: A 1.625,0; C -1.625,0
TM23_RJ45 = drill 0.8 round: P$1 3.556,11.24; P$2 2.54,8.7; P$3 1.524,4.7; P$4 0.508,11.24; P$5 -0.508,8.7; P$6 -1.524,4.7; P$7 -2.54,8.7; P$8 -3.556,11.24 | hole 2.4: -7.5,6; 7.5,6
98414-G06-08ULF = drill 0.8 round: P$1 -3,-1; P$2 -3,1; P$3 -1,-1; P$4 -1,1; P$5 1,-1; P$6 1,1; P$7 3,-1; P$8 3,1
6410-03 = drill 1.016 long: 1 2.54,0; 2 0,0; 3 -2.54,0
8PIN_CON_AMP_SMD = smd 1.5 x 3: P$9 0,2.25; P$10 1.27,-2.25; P$11 2.54,2.25; P$12 3.81,-2.25; P$13 5.08,2.25; P$14 6.35,-2.25; P$15 7.62,2.25; P$16 8.89,-2.25
8PIN_CON_AMP = drill 0.8 round: P$1 0,0; P$2 1.27,2.54; P$3 2.54,0; P$4 3.81,2.54; P$5 5.08,0; P$6 6.35,2.54; P$7 7.62,0; P$8 8.89,2.54 | hole 1.5: -1.4,1.8
PROG_CON_WITH_VERSION = drill 0.8 round: P$1 0,0; P$2 -2.54,1.27; P$3 0,2.54; P$4 -2.54,3.81; P$5 0,5.08; P$6 -2.54,6.35 | hole 1.5: -1.8,-1.4
PTDA_1.5_X-PH_5.0 = drill 1.5 long: P$1 0,0; P$2 5,0; P$3 10,0; P$4 15,0 | drill 1.3 long: P$5 0,3.5; P$6 5,3.5; P$7 10,3.5; P$8 15,3.5
6PIN_CON_AMP = drill 0.8 round: P$1 0,-1.27; P$2 1.27,1.27; P$3 2.54,-1.27; P$4 3.81,1.27; P$5 5.08,-1.27; P$6 6.35,1.27 | hole 1.5: -1.4,0.53
JP1 = drill 0.914 long: 1 0,-1.27; 2 0,1.27
FTR-LY_RIGHT_ANGLE = drill 1 square: P$1 0.7,-0.06 | drill 1 round: P$2 4.48,-0.06 | drill 1.3 round: P$3 15.82,-0.06; P$4 20.86,-0.06; P$5 25.9,-0.06
SOT23_6 = smd 0.6 x 0.9: 1 -0.95,-1.15; 2 0,-1.15; 3 0.95,-1.15; 4 0.95,1.15; 5 0,1.15; 6 -0.95,1.15
R0603 = smd 1 x 1.1: 1 -0.85,0; 2 0.85,0
B3F_10XX = drill 1.016 long: 1 -3.251,2.261; 2 3.251,2.261; 3 -3.251,-2.261; 4 3.251,-2.261
SOT363 = smd 0.35 x 0.9: 1 0,0; 2 0.65,0; 3 1.3,0; 4 1.3,2.25; 5 0.65,2.25; 6 0,2.25
BB_BLACK_PINS = drill 0.9 round: P$1 -25.4,19.685; P$2 -22.86,19.685; P$3 -25.4,22.225; P$4 -22.86,22.225; P$5 -25.4,24.765; P$6 -22.86,24.765; P$7 -25.4,27.305; P$8 -22.86,27.305; P$9 -25.4,29.845; P$10 -22.86,29.845; P$11 -25.4,32.385; P$12 -22.86,32.385; P$13 -25.4,34.925; P$14 -22.86,34.925; P$15 -25.4,37.465; P$16 -22.86,37.465; P$17 -25.4,40.005; P$18 -22.86,40.005; P$19 -25.4,42.545; P$20 -22.86,42.545; P$21 -25.4,45.085; P$22 -22.86,45.085; P$23 -25.4,47.625; P$24 -22.86,47.625; P$25 -25.4,50.165; P$26 -22.86,50.165; P$43 -25.4,73.025; P$44 -22.86,73.025; P$45 -25.4,75.565; P$46 -22.86,75.565; P$47 22.86,19.685; P$48 25.4,19.685; P$49 22.86,22.225; P$50 25.4,22.225; P$57 22.86,32.385; P$58 25.4,32.385; P$59 22.86,34.925; P$60 25.4,34.925; P$61 22.86,37.465; P$62 25.4,37.465; P$63 22.86,40.005; P$64 25.4,40.005; P$79 22.86,60.325; P$80 25.4,60.325; P$81 22.86,62.865; P$82 25.4,62.865; P$83 22.86,65.405; P$84 25.4,65.405
SC70_6P = smd 0.35 x 0.8: 1 -0.65,-0.85; 2 0,-0.85; 3 0.65,-0.85; 4 0.65,0.85; 5 0,0.85; 6 -0.65,0.85
DIL8 = drill 0.813 long: 1 -3.81,-3.81; 2 -1.27,-3.81; 3 1.27,-3.81; 4 3.81,-3.81; 5 3.81,3.81; 6 1.27,3.81; 7 -1.27,3.81; 8 -3.81,3.81
TQFP64-10X10 = smd 1.2 x 0.3: 1 -5.7,3.75; 2 -5.7,3.25; 3 -5.7,2.75; 4 -5.7,2.25; 5 -5.7,1.75; 6 -5.7,1.25; 7 -5.7,0.75; 8 -5.7,0.25; 9 -5.7,-0.25; 10 -5.7,-0.75; 11 -5.7,-1.25; 12 -5.7,-1.75; 13 -5.7,-2.25; 14 -5.7,-2.75; 15 -5.7,-3.25; 16 -5.7,-3.75; 33 5.7,-3.75; 34 5.7,-3.25; 35 5.7,-2.75; 36 5.7,-2.25; 37 5.7,-1.75; 38 5.7,-1.25; 39 5.7,-0.75; 40 5.7,-0.25; 41 5.7,0.25; 42 5.7,0.75; 43 5.7,1.25; 44 5.7,1.75; 45 5.7,2.25; 46 5.7,2.75; 47 5.7,3.25; 48 5.7,3.75 | smd 0.3 x 1.2: 17 -3.75,-5.7; 18 -3.25,-5.7; 19 -2.75,-5.7; 20 -2.25,-5.7; 21 -1.75,-5.7; 22 -1.25,-5.7; 23 -0.75,-5.7; 24 -0.25,-5.7; 25 0.25,-5.7; 26 0.75,-5.7; 27 1.25,-5.7; 28 1.75,-5.7; 29 2.25,-5.7; 30 2.75,-5.7; 31 3.25,-5.7; 32 3.75,-5.7; 49 3.75,5.7; 50 3.25,5.7; 51 2.75,5.7; 52 2.25,5.7; 53 1.75,5.7; 54 1.25,5.7; 55 0.75,5.7; 56 0.25,5.7; 57 -0.25,5.7; 58 -0.75,5.7; 59 -1.25,5.7; 60 -1.75,5.7; 61 -2.25,5.7; 62 -2.75,5.7; 63 -3.25,5.7; 64 -3.75,5.7
SOIC-8 = smd 2.032 x 0.66: 1 -3.073,1.27; 2 -3.073,0; 3 -3.073,-1.27; 4 -3.073,-2.54; 5 3.073,-2.54; 6 3.073,-1.27; 7 3.073,0; 8 3.073,1.27
SO08 = smd 0.66 x 2.032: 1 -1.905,-3.073; 2 -0.635,-3.073; 3 0.635,-3.073; 4 1.905,-3.073; 5 1.905,3.073; 6 0.635,3.073; 7 -0.635,3.073; 8 -1.905,3.073
OKI-78SR = drill 1 long: P$1 0,0; P$2 2.54,0; P$3 5.08,0
SOT223 = smd 1.5 x 2: 1 -2.3,-3.15; 2 0,-3.15; 3 2.3,-3.15 | smd 3.8 x 2: 4 0,3.15
SOIC18 = smd 0.66 x 2.032: 1 0.635,0.737; 2 1.905,0.737; 3 3.175,0.737; 4 4.445,0.737; 5 5.715,0.737; 6 6.985,0.737; 7 8.255,0.737; 8 9.525,0.737; 9 9.525,6.883; 10 8.255,6.883; 11 6.985,6.883; 12 5.715,6.883; 13 4.445,6.883; 14 3.175,6.883; 15 1.905,6.883; 16 0.635,6.883
SM49 = smd 5.08 x 1.778: 1 -4.826,0; 2 4.826,0
MM20SS = smd 1.27 x 1.88: 1 -2.794,-1.524; 2 2.794,-1.524; 3 2.794,1.524; 4 -2.794,1.524

### Placement (x,y rotation side)
B1  13.66,52.41 0 top
C1  81.8,65.19 270 top
C2  64.14,67.82 270 top
C3  73.91,33.02 0 top
C4  76.96,30.99 90 top
C5  67.31,33.02 180 top
C6  70.61,33.02 0 top
C7  85.22,16.38 90 top
C8  63.75,22.6 180 top
C9  74.67,22.59 180 top
C10  49.34,33.23 180 top
C11  32.95,33.32 0 top
C12  2.11,53.65 90 top
C13  30.73,37.08 270 top
C14  41.91,32.38 0 top
C15  38.48,32.38 180 top
C16  55.88,34.04 270 top
C17  10.84,44.01 270 top
C18  40.07,47.33 180 top
C19  9.14,67.82 270 top
C20  16.51,62.74 270 top
C21  14.22,23.88 270 top
C22  97,71.25 180 top
C23  97,62 0 top
C24  97.03,59.69 0 top
C25  97.03,57.4 0 top
C26  101.25,59.75 270 top
C27  49.85,35.44 180 top
C28  46.9,47.01 270 top
C29  22.48,36.83 90 top
C30  13.08,38.35 180 top
C31  19.68,38.35 0 top
C32  16.38,38.35 0 top
C33  24.26,30.23 0 top
D1  82.18,70.43 0 top
D2  82.68,17.53 0 top
D3  25.15,37.08 90 top
D4  30.27,29.79 270 top
D5  40.89,62.99 180 top
D6  91.75,71.25 180 top
J1  92.5,-0.5 0 top
J2  99,46 90 top
J3  62.66,7.91 0 top
J4  74.01,7.91 0 top
J5  97.75,21 90 top
J6  6.96,24.5 90 top
J7  7.63,77.08 0 top
J8  19.81,7.62 0 top
J9  29.5,77.22 0 top
J10  82.75,77.22 0 top
J11  10.29,7.62 0 top
J13  42.67,9.4 270 top
JP1  74,80 0 top
JP2  28.83,7.62 0 top
JP3  33.4,7.62 180 top
JP4  3.17,6.6 180 top
JP5  23,80 0 top
K1  68.03,36.03 90 top
LOGO2  1.27,17.02 0 top
Q1  59.32,31.73 270 top
R1  64.77,70.48 180 top
R2  80.01,70.61 90 top
R3  45.41,66.34 0 top
R4  45.41,70.11 0 top
R5  45.41,64.48 0 top
R6  45.41,68.26 0 top
R7  50.67,41.15 90 top
R8  77.72,70.61 270 top
R9  88.08,70.42 270 top
R10  81.53,59.44 270 top
R11  72.39,18.29 90 top
R12  74.17,18.29 90 top
R13  75.95,18.29 90 top
R14  77.72,18.29 90 top
R15  87,16.38 270 top
R16  85.09,23.62 180 top
R17  85.09,25.15 180 top
R18  86.11,18.92 0 top
R19  6.86,67.56 90 top
R20  4.57,67.56 90 top
R21  26.92,37.08 90 top
R22  28.83,37.08 270 top
R23  10.37,52 90 top
R24  21.08,16.76 90 top
R25  18.92,16.76 90 top
R26  42.42,59.94 180 top
R27  10.67,23.88 270 top
R28  12.95,62.74 270 top
R29  34.95,62.72 90 top
R30  12.45,23.88 90 top
R31  14.73,62.74 90 top
R32  45.47,53.09 180 top
R33  39.12,59.94 180 top
R34  59.56,26.54 270 top
R35  61.34,26.54 90 top
R36  59.3,29.06 180 top
R37  62.55,33.14 270 top
R38  59.82,67.31 270 top
R39  59.21,34.22 0 top
R40  44.58,49.02 0 top
R41  10.16,16.76 90 top
R42  8,16.76 90 top
R43  21.46,22.48 0 top
R44  21.46,24.38 0 top
R46  45.47,51.05 0 top
R47  45.47,54.99 0 top
S3  64.9,80.11 270 top
S4  15.4,79.99 270 top
T1  54.61,24.64 270 top
T2  83.82,31.24 0 top
T3  10.29,33.15 180 top
U1  89,43.25 90 top
U2  31.37,18.54 0 top
U3  6.23,60.41 90 top
U4  40.56,39.65 270 top
U5  6.21,41.21 270 top
U6  19.94,20.32 90 top
U7  40.91,54.32 0 top
U8  94.2,65.15 0 top
U9  52.7,28.88 90 top
U10  75.7,31.58 180 top
U11  85.48,62.55 0 top
U12  21.46,36.83 180 top
U$1  CNMB/6  [CNMB/6-]  -1.5,-1.75 0 top
U$4  [FIDUCIAL_G10]  100,15 0 bottom
U$5  73.28,61.47 90 top
U$6  [FIDUCIAL_G10]  3,71 0 top
U$7  [FIDUCIAL_G10]  3,15 0 top
U$8  [FIDUCIAL_G10]  100,15 0 top
U$11  [FIDUCIAL_G10]  3,15 0 bottom
U$12  [FIDUCIAL_G10]  3,71 0 bottom
Y1  40.2,28.73 0 top
Y2  5.84,50.37 90 top

### Tracks (layer width: path | path; a pad name or v marks a point on that pad's centre or on a via)
0V  (via drill 0.6)
  Top 0.305: T2.4 86.32,33.49 v86.36,33.53 | T3.1 10.29,32.51 10.41,32.38 v11.43,32.38 | R39.2 60.06,35.95 v58.8,37.21 | C16.1 v55.88,36.32
  Bottom 0.305: v58.8,37.21 56.77,37.21 v55.88,36.32
  other vias: 83.31,29.72 32.89,30.48 30.61,33.53 43.81,47.37 39.75,43.56 44.45,38.35 45.72,34.54 53.85,27.18 53.85,25.91 9.14,28.83 2.92,42.16 10.92,46.23 2.03,51.31 15.88,65.28 8.13,65.53 43.05,67.18 8.89,38.23 9.02,34.67 57.78,26.16 56.9,22.23 61.59,28.96 62.74,26.8 61.34,22.1 78.11,35.05 81.79,21.34 86.36,31.11 22.1,20.7 32,16.51 88.77,57.91 79.63,61.72 65.91,61.98 62.61,61.47 58.8,62.36 53.98,64.01 65.66,58.93 70.87,35.81 62.48,41.78 66.42,27.43 78.11,28.96 96.39,45.97 81.28,32.64 90.93,14.48 93.98,14.48 97.16,14.48 88.01,14.48 90.93,23.5 96.39,34.42 94.11,17.78 97.16,19.3 64.01,65.28 98.93,32.64 101.85,36.2 99.06,39.88 95.12,37.21 88.52,32.77 90.93,27.56 95,33.15 76.2,33.27 8,31.11 22.99,27.81 25.91,24.77 24.26,22.1 28.96,27.43 36.96,20.32 36.96,17.53 22.48,18.8 11.94,15.24 6.22,15.37 12.19,26.04 60.45,43.94 57.4,40.51 60.33,39.37 53.85,39.62 50.67,43.69 48.01,40.26 78.87,26.54 86.23,20.95 82.68,14.99 41.02,36.45 50.93,31.62 51.82,37.34 52.2,42.04 51.44,45.97 51.44,56.52 58.55,56.39 62.48,52.58 62.61,49.15 59.31,49.15 54.61,62.23 31.37,67.18 35.31,67.18 35.31,65.15 31.37,65.15 22.99,56.9 21.72,54.74 10.92,41.53 14.73,41.53 14.73,44.58 9.14,71.5 81.79,67.56 97.79,69.34 99.06,69.34 93.47,61.98 93.47,59.69 93.47,57.4 17.78,32.51 26.54,29.72
  pour Top: 0,0 103.12,0 103.12,86.61 0,86.61
  pour Route15: 0,0 103.12,0 103.12,86.61 0,86.61
  pour VCC (rank 2): 0,0 103.12,0 103.12,86.61 42.04,86.49 39.75,86.61 39.62,86.61 0,86.61
  pour Bottom: 0,0 103.12,0 103.12,86.61 0,86.61
12V
  Top 1.422: U8.P$1 94.2,67.78 95.5,69.09 95.5,71.23 C22.+ D6.C
12V_IN  (via drill 0.6)
  Top 1.27: D6.A 91.57,71.25 v91.69,71.37
  VCC 1.27: 92.75,71.37 v91.69,71.37
  VCC 1.778: J10.P$3 J10.P$7
  VCC 1.93: 69.22,57.78 68.32,56.89 K1.P$4
  VCC 3.81: J10.P$3 92.75,71.37 92.75,69.38 83.06,59.43 81.41,57.78 69.22,57.78
12V_OUT
  VCC 1.676: 67.31,51.94 67.65,51.85 K1.P$3
  VCC 1.778: J9.P$3 J9.P$7
  VCC 3.81: J9.P$3 39.62,77.38 39.62,64.26 44.41,59.47 59.87,59.44 67.31,51.94
+3V3  (via drill 0.6)
  Top 0.254: C28.2 46.14,45.12 v45.97,44.96
  Top 0.305: U4.26 36.58,38.9 v36.58,38.86 | U4.19 36.3,42.4 v36.58,42.67 36.35,42.9 U4.18 | U4.38 39.31,34.74 v40.13,35.56 | U4.57 44.69,39.9 v44.45,40.13 | U6.5 18.16,20.32 16.38,22.1 10.79,22.1 10.67,22.23 R27.2
  Top 0.406: 5.84,68.41 R20.2 | 5.84,68.41 R19.2 | C12.2 2.11,56.29 U3.8 | v5.59,70.1 5.59,68.67 5.84,68.41 | D3.1 26.55,38.18 R21.2 v25.78,39.62 | R27.2 9.49,23.03 v9.14,23.37 | v12.95,60.45 R28.2 | C11.2 34.97,33.32 v35.31,33.66
  Top 0.61: U3.8 6.05,56.6 v6.1,56.64 | C27.+ 48.37,37.23 v48.26,37.34 | U12.16 21.95,29.95 v22.1,30.1 22.23,30.23 C33.1
  Top 1.016: U9.4 48.37,30.05 48.37,33.27 | 48.37,33.27 C27.+ | C10.2 48.45,33.27 48.37,33.27
  VCC 0.254: v45.97,44.96 45.97,44.45
  VCC 0.305: v36.58,38.86 36.58,39.88 | v36.58,42.67 37.08,42.67 | v44.45,40.13 44.45,39.37
  VCC 0.406: 6.1,60.45 v12.95,60.45 | v35.31,33.66 35.56,33.53
  VCC 0.61: v5.59,70.1 6.1,69.6 6.1,60.45 v6.1,56.64 6.1,53.85 7.11,52.83 9.91,52.83 22.73,40.01 | 22.73,40.01 22.86,39.88 25.53,39.88 v25.78,39.62 27.05,38.35 39.37,38.35 40.64,39.62 | v48.26,37.34 44.45,37.34 | 22.73,40.01 22.73,30.61 v22.1,30.1 14.35,30.1 9.14,24.89 v9.14,23.37
  pour VCC: 34.29,33.53 34.29,45.72 46.74,45.72 46.74,33.53
+5V  (via drill 0.6)
  Top 0.406: C19.1 9.56,68.67 v10.67,67.56 | U5.8 7.48,39.9 v6.99,40.39 | v9.27,43.05 10.73,43.05 C17.2 | v59.08,40.49 59.05,40.51
  Top 0.61: U7.8 39,55.74 38.63,55.37 v38.61,55.37 | R26.1 44.2,59.02 44.2,56.9 v44.07,56.77 | 57.15,31.73 56.4,31.73 U9.3 | 57.15,31.73 Q1.2 | Q1.3 56.25,30.78 U9.3 | C16.2 55.88,31.21 U9.3 | 59.05,40.51 57.15,38.61 57.15,31.73 | C17.2 10.86,43.18 v12.83,43.18 v22.86,43.18
  VCC 0.406: v6.99,40.39 6.99,40.77 v9.27,43.05
  VCC 0.61: J7.P$2 5.09,78.24 3.56,76.71 3.56,74.68 v10.67,67.56 22.86,55.37 | 22.86,55.37 v38.61,55.37 40.01,56.77 v44.07,56.77 44.83,56.77 49.15,56.77 50.67,55.24 53.21,55.24 56.13,52.32 56.13,43.43 v59.08,40.49 K1.P$2 | v22.86,43.18 22.86,55.37 | J6.P$8 5.95,33.38 12.45,39.88 12.45,42.8 v12.83,43.18
  Route15 0.406: v59.08,40.49 59.03,40.45 58.99,40.45
BB_BUT_TOP  (via drill 0.6)
  Top 0.406: D2.2 84.43,17.23 C7.2 85.22,18.88 R18.1 85.26,20.41 81.66,24 v81.66,25.27 | v60.45,42.16 56.9,45.85 56.9,63.5 55.37,65.02 55.37,67.35 U1.P$60
  Bottom 0.406: v81.66,25.27 81.66,29.21 76.33,34.54 68.07,34.54 66.93,35.69 66.93,36.45 66.29,37.08 65.53,37.08 63.25,39.37 62.1,39.37 60.45,41.02 v60.45,42.16
BB_STAT_1  (via drill 0.6)
  Top 0.305: T2.2 84.47,29.48 80.64,25.65 80.66,16.65 v79.76,15.75
  VCC 0.305: v79.76,15.75 53.64,15.75 U1.P$15
BB_STAT_2  (via drill 0.6)
  Top 0.305: v79.76,17.53 79.76,27.18 82.04,29.46 82.04,31.75 82.8,32.51 84.33,32.51 84.47,32.65 T2.5
  VCC 0.305: U1.P$12 57.91,19.09 57.91,17.53 59.18,16.26 78.49,16.26 v79.76,17.53
BUT  (via drill 0.6)
  Top 0.305: U4.48 45.05,33.95 45.09,33.91 45.08,33.92 v46.1,32.51
  Top 0.406: R30.1 C21.2 15.66,23.03 20.83,28.19 21.97,28.19 22.48,28.7 v27.43,28.7 28.79,28.7 D4.2
  Bottom 0.305: v46.1,32.51 42.04,28.7 v27.43,28.7
BUT2  (via drill 0.6)
  Top 0.305: U4.47 43.81,33.15 43.82,33.15 44.45,32.51 v44.7,32.51
  Top 0.406: R31.1 C20.2 18.96,61.89 v19.05,61.98 | v27.43,30.73 28.2,30.73 D4.1
  VCC 0.406: v23.88,38.73 23.88,34.29 v27.43,30.73
  Bottom 0.305: v44.7,32.51 42.8,30.73 34.04,30.73 33.4,31.37 32.13,31.37 31.5,30.73 v27.43,30.73
  Bottom 0.406: v19.05,61.98 19.81,61.98 24.89,56.9 24.89,39.75 v23.88,38.73
BUT3  (via drill 0.6)
  Top 0.406: v14.73,72.39 R31.2 R28.1
  Bottom 0.406: v14.73,72.39 13.13,73.99 S4.4 S4.3
BUT_TOP
  Top 0.406: J6.P$2 9.63,25.77 R27.1 R30.2
DATA0
  Top 0.305: U4.63 47.72,42.9 48.26,43.43 48.26,50.04 48.64,50.42 48.64,55.5 48.26,55.88 48.26,63.5 50.8,66.04 51.47,66.04 U1.P$61
  Top 0.406: R3.2 47.29,66.34 48.26,67.31 50.34,67.31 U1.P$61
DATA1
  Top 0.305: U4.62 47.98,42.4 48.77,43.18 48.77,49.78 49.15,50.16 49.15,55.75 48.77,56.13 48.77,62.99 50.55,64.77 52.07,64.77 52.83,65.53 52.83,67.35 U1.P$62
  Top 0.406: R4.2 50.07,70.11 U1.P$62
DATA2  (via drill 0.6)
  Top 0.305: U4.61 48.24,41.9 49.28,42.93 49.28,49.53 49.66,49.91 49.66,56.01 49.28,56.39 49.28,62.23 v50.8,63.75
  Top 0.406: R5.2 47.37,64.48 U1.P$63
  Bottom 0.305: v50.8,63.75 50.8,64.31 U1.P$63
DATA3  (via drill 0.6)
  Top 0.305: U4.60 48.51,41.4 49.78,42.67 49.78,49.28 50.16,49.66 50.16,56.26 49.78,56.64 49.78,61.47 v50.8,62.48
  Top 0.406: R6.2 48.6,68.26 U1.P$64
  Bottom 0.305: v50.8,62.48 51.05,62.48 51.82,63.25 51.82,64.26 50.29,65.79 50.29,67.35 U1.P$64
DIRA  (via drill 0.6)
  Top 0.305: U4.30 33.97,36.9 33.66,37.21 33.66,39.12 v33.27,39.5 33.66,39.88 33.66,46.35 v34.54,47.24 | R32.1 R46.2 v47.62,51.05
  VCC 0.305: v47.62,51.05 38.35,51.05 v34.54,47.24
  Bottom 0.305: v33.27,39.5 33.27,37.72 29.46,33.91 26.42,33.91 25.27,32.77 25.27,28.83 29.46,24.64 29.46,22.1 31.5,20.07 33.78,20.07 35.31,18.54 35.31,14.61 37.72,12.19 37.72,10.29 39.88,8.13 42.16,8.13 43.43,6.86 44.45,6.86 45.47,5.84 45.47,5.08 44.7,4.32 J13.P$5
I2C1_SCL  (via drill 0.6)
  Top 0.406: J5.P$12 88.56,24.81 v87.38,23.62 R16.1
  Bottom 0.406: U1.P$17 50.29,19.15 50.29,21.08 53.09,23.88 70.87,23.88 71.12,23.62 v87.38,23.62
I2C1_SDA  (via drill 0.6)
  Top 0.406: J5.P$13 88.31,26.08 v87.38,25.15 R17.1
  Bottom 0.406: U1.P$18 49.02,20.42 49.02,20.83 52.83,24.64 71.12,24.64 71.37,24.38 86.61,24.38 v87.38,25.15
M_RS485_A  (via drill 0.6)
  Top 0.61: v36.32,70.87 36.32,67.56 D5.K 41.57,62.32 R26.2 41.54,59.92 U7.6
  Bottom 0.61: JP5.2 29.18,81.32 J9.P$5 J9.P$1 29.5,74.39 33.02,70.87 v36.32,70.87
M_RS485_B  (via drill 0.6)
  Top 0.61: v34.29,72.14 34.29,64.23 R29.2 36.55,63.57 D5.A 37.85,62.99 39.97,60.87 R33.1 40.27,59.64 U7.7
  Bottom 0.61: J9.P$6 J9.P$2 34.29,77.29 v34.29,72.14
MCLR#1  (via drill 0.6)
  Top 0.305: U4.7 41.31,43.78 v41.4,43.69 | v28.19,41.91 28.32,41.91 28.83,41.4 v28.83,39.37
  Top 0.406: R22.1 v28.83,39.37
  Bottom 0.305: v41.4,43.69 41.4,42.67 40.39,41.66 28.45,41.66 v28.19,41.91
  Bottom 0.406: J7.P$1 7.75,76.83 9.91,74.68 9.91,72.9 25.65,57.15 25.65,41.15 27.43,39.37 v28.83,39.37
N$1
  VCC 0.305: 97.35,44.01 99,44.01 J2.P$1
  VCC 0.406: J1.P$8 88.94,29.51 96.77,37.34 96.77,43.43 97.35,44.01
N$2
  Top 0.406: U10.3 72.53,32.61 C3.1
N$3
  Top 0.406: R39.1 58.17,34.03 Q1.1
N$4  (via drill 0.6)
  Top 0.406: R8.1 v77.72,72.77
  Bottom 0.406: v77.72,72.77 77.72,75.08 JP1.1
N$5
  Top 0.406: U5.1 7.48,47.46 Y2.1
N$6
  Top 0.406: Q1.6 59.86,32.68 59.44,32.26 59.44,30.04 R36.2
N$7
  VCC 0.406: J1.P$7 89.96,29.37 97.93,37.34 97.92,42.93 J2.P$2
N$8
  Top 0.406: U5.2 6.21,45.68 Y2.4
N$9  (via drill 0.6)
  Top 0.406: v2.29,45.97 4.57,45.97 4.94,45.61 U5.3
  Bottom 0.406: v2.29,45.97 1.52,45.21 1.52,13.21 3.17,11.56 JP4.1
N$10  (via drill 0.6)
  Top 0.406: v9.14,51.05 10.27,51.05 R23.1
  VCC 0.406: v9.14,51.05 3.56,51.05 1.27,48.77 1.27,7.24 JP4.2
N$11
  Top 0.406: R23.2 13.47,52.85 B1.POS
N$12
  Top 0.406: J5.P$10 89.2,22.27 87,20.07 87,18.96 R18.2 86.96,17.27 R15.1
N$13
  VCC 0.406: J1.P$6 90.98,11.73 91.95,12.7 91.99,28.75 101.09,37.85 101.09,43.91 J2.P$3
N$14
  Route15 0.406: J1.P$5 91.99,32.56 96.01,36.58 96.01,43.69 97.28,44.96 97.96,44.96 J2.P$4
N$15
  Route15 0.305: 98.49,44.01 99,44.51 99,46 J2.P$5
  Route15 0.312: 97.41,44.01 98.49,44.01
  Route15 0.406: J1.P$4 93.01,32.43 96.77,36.2 96.77,43.43 97.41,44.01
N$16
  Top 0.406: U10.2 73.8,29.58 74.33,29.04 76.37,29.04 76.96,29.72 C4.1
N$17
  Top 0.406: U10.6 68.72,32.46 C5.1
N$18
  Top 0.406: U10.1 75.07,33.27 C3.2
N$19  (via drill 0.6)
  Top 0.406: v72.39,14.73 R11.1
  Bottom 0.406: 62.66,8.81 J3.2 60.59,5.84 59.69,5.84 58.93,6.6 58.93,9.65 61.47,12.19 69.85,12.19 v72.39,14.73
N$20
  VCC 0.305: 100.58,48.01 99.01,48.01
  VCC 0.406: J1.P$3 94.02,11.64 92.96,12.7 93.01,28.62 101.73,37.34 101.73,46.86 100.58,48.01 | 99.01,48.01 J2.P$6
N$21
  Top 0.406: U10.4 71.26,33.07 C6.2
N$22
  Route15 0.406: J1.P$2 95.04,31.79 101.09,37.85 101.09,47.91 J2.P$7
N$23
  Top 0.406: U10.5 69.99,33.05 C6.1
N$24  (via drill 0.6)
  Top 0.406: v74.17,14.73 R12.1
  Bottom 0.406: J3.3 60.12,8.05 63.5,11.43 70.87,11.43 v74.17,14.73
N$25  (via drill 0.6)
  Top 0.406: v75.95,14.73 R13.1
  Bottom 0.406: J4.2 74.01,12.8 v75.95,14.73
N$26
  Route15 0.406: J1.P$1 96.06,31.67 101.73,37.34 101.73,48.9 100.58,50.04 99.04,50.04 J2.P$8
N$27  (via drill 0.6)
  Top 0.406: v77.72,14.73 R14.1
  Bottom 0.406: J4.3 73.54,5.84 76.96,5.84 77.72,6.6 v77.72,14.73
N$28  (via drill 0.6)
  Top 0.305: 53.37,23.34 T1.3
  Top 0.406: 53.37,23.34 52.83,23.88 52.83,32.64 54.48,34.29 54.48,36.83 v55.24,37.59 | v65.91,35.94 66.7,36.73 K1.P$1
  Bottom 0.406: v55.24,37.59 56.01,38.35 63.25,38.35 65.66,35.94 v65.91,35.94
N$29  (via drill 0.6)
  Top 0.406: T2.6 83.82,34.29 84.33,34.8 94.61,34.8 97.66,31.75 v97.66,31.24 | J5.P$14 99.95,27.3 v97.66,27.3
  Bottom 0.406: v97.66,31.24 v97.66,27.3
N$30
  Top 0.406: T2.3 85.12,30.7 87.2,28.62 J5.P$15
N$31  (via drill 0.6)
  Top 0.406: v21.72,14.48 21.08,15.11 R24.1
  Bottom 0.406: J8.2 19.81,12.57 v21.72,14.48
N$32  (via drill 0.6)
  Top 0.406: R25.1 18.92,14.99 v18.67,14.73
  Bottom 0.406: v18.67,14.73 17.27,13.34 J8.3
N$33
  Top 0.305: T3.6 10.29,30.23 10.03,29.97 8,29.97 7.11,30.86 4.44,30.86 J6.P$6
N$34
  Top 0.305: J6.P$7 8.49,32.12 8.99,32.61 T3.3
N$35  (via drill 0.6)
  Top 0.305: v30.86,15.88 30.72,16.02 U2.1
  Bottom 0.406: v30.86,15.88 35.43,11.3 35.43,8.26 34.8,7.62 32.26,7.62 30.99,8.89 JP2.2
N$36  (via drill 0.6)
  Top 0.305: v29.08,15.88 27.69,17.27 27.69,19.68 28.45,20.45 31.62,20.45 32,20.07 32,19.41 U2.4
  Bottom 0.406: JP3.1 29.08,13.21 v29.08,15.88
N$37
  Top 0.305: T1.5 56.15,23.99 55.88,24.26 55.88,24.89 56.26,25.27 58.42,25.27 58.8,25.65 59.52,25.65 R34.2 R35.1
N$38
  Top 0.406: R38.2 61.47,64.81 61.47,32.77 61.95,32.29 R37.2 62.52,32.26 61.72,32.26 61.19,31.73 Q1.5
N$39
  Top 0.406: R13.2 75.95,20.07 77.22,21.34 77.22,25.91 75.95,27.18 68.33,27.18 66.18,29.32 U10.8
N$40
  Top 0.406: U10.7 67.45,29.07 68.58,27.94 76.2,27.94 77.98,26.16 77.98,19.3 77.81,19.14 R14.2
N$41
  Top 0.406: U10.13 71.26,21.2 72.39,20.07 R11.2
N$42
  Top 0.406: U10.14 72.53,21.7 74.17,20.07 R12.2
N$43
  Top 0.406: U12.3 18.29,37.81 C31.1
N$44
  Top 0.406: U12.5 15.75,38.14 C32.1
N$45
  Top 0.406: U12.2 19.56,35.05 19.94,34.67 21.46,34.67 22.48,35.69 C29.1
N$46
  Top 0.406: U12.6 14.48,37.81 C30.1
N$47
  Top 0.406: U12.1 20.83,38.06 C31.2
N$48
  Top 0.406: U12.4 17.02,38.14 C32.2
N$49  (via drill 0.6)
  Top 0.61: R29.1 34.14,61.87 32.51,63.5 32.51,69.34 30.48,71.37 24.13,71.37 v23.37,72.14
  Bottom 0.61: JP5.1 23.26,72.25 v23.37,72.14
N$50  (via drill 0.6)
  Top 0.406: v10.16,14.61 R41.1
  Bottom 0.406: v10.16,14.61 10.16,7.87 J11.2
N$51  (via drill 0.6)
  Top 0.406: v8,14.61 R42.1
  Bottom 0.406: v8,14.61 8,7.87 J11.3
N$52  (via drill 0.6)
  Top 0.305: v19.3,22.48 R43.1 | v14.48,27.81 U12.11
  VCC 0.305: v19.3,22.48 17.91,22.48 14.48,25.91 v14.48,27.81
N$53  (via drill 0.6)
  Top 0.305: R44.1 19.81,24.38 v19.3,23.88 | v15.75,27.81 U12.12
  VCC 0.305: v19.3,23.88 17.78,23.88 15.75,25.91 v15.75,27.81
N$55
  Top 0.305: R40.1 43.18,49.53 42.8,49.91 42.8,51.23 U7.4
N$56  (via drill 0.6)
  Top 0.406: v17.02,27.81 U12.13 | R41.2 v10.16,20.07
  Bottom 0.406: v17.02,27.81 18.03,26.8 18.03,25.91 17.14,25.02 15.11,25.02 v10.16,20.07
N$57  (via drill 0.6)
  Top 0.406: U12.14 18.29,27.18 17.4,26.29 v17.02,26.29 | R42.2 v8,20.07
  Bottom 0.406: v17.02,26.29 14.22,26.29 v8,20.07
N$60
  Top 0.254: U7.2 U7.3
  Top 0.305: U7.3 41.54,52.46 42.04,52.96 43.18,52.96 R46.1
N$61
  Top 0.305: U7.1 39,52.59 41.53,54.99 R47.1
N$62
  Top 0.305: Y1.1 38.51,28.73 39.33,29.55 C15.1 39.81,32.87 U4.39
N$63
  Top 0.305: Y1.2 42.39,28.73 41.15,29.97 41.15,32.26 C14.1 | C14.1 41.31,31.92 | C14.1 40.31,33 U4.40
N$444
  Top 0.406: D3.2 26.55,35.98 R21.1 R22.2 C13.2
PGC#1  (via drill 0.6)
  Top 0.254: U4.42 41.31,34.96 v41.91,35.56
  Bottom 0.254: v41.91,35.56 41.91,36.83 37.59,40.89 27.94,40.89 27.18,41.66
  Bottom 0.406: J7.P$5 8,82.17 11.43,78.74 11.43,73.41 27.18,57.66 27.18,41.66
PGD#1  (via drill 0.6)
  Top 0.254: v39.24,36.45 39.24,35.31 38.81,34.88 U4.37
  Bottom 0.254: v39.24,36.45 38.23,37.47 36.58,37.47 33.66,40.39 27.43,40.39 26.42,41.4
  Bottom 0.406: J7.P$4 7.88,80.89 10.67,78.11 10.67,73.15 26.42,57.4 26.42,41.4
POWER_MASTER
  Top 0.406: U1.P$58 57.1,68.16 R38.1
POWER_OUT  (via drill 0.6)
  Top 0.305: U4.53 47.42,37.9 48.13,38.61 v51.69,38.61 | v57.91,27.43 57.95,27.39 R34.1
  VCC 0.305: v51.69,38.61 55.63,38.61 57.91,36.32 v57.91,27.43
RESET  (via drill 0.6)
  Top 0.305: T1.6 57.91,24.64 59.18,23.37 59.18,21.59 59.31,21.72
  Top 0.406: v63.75,72.39 63.75,70.65 R1.2 63.75,70.32 63.21,70.32 62.61,69.72 62.61,63.25 63.63,62.23 63.63,26.04 59.31,21.72 59.16,21.56 U1.P$10
  Bottom 0.406: v63.75,72.39 62.64,73.51 S3.4 S3.3
RESET_BB
  Top 0.305: T1.2 55.39,23.99 55.75,23.62 55.75,22.99 55.24,22.48 53.21,22.48 52.07,23.62 52.07,33.4 52.83,34.16 52.83,39.24 51.82,40.26 R7.1 50.63,40.26 49.78,40.26 48.64,39.12 47.88,39.12 47.16,38.4 U4.54
RS485_A  (via drill 0.6)
  Top 0.406: 86.12,70.25 86.25,70.25 87.12,71.12 87.93,71.12 R9.1
  Top 0.61: D1.A 86.12,70.25 U11.6
  Top 0.813: D1.A 85.94,72.3 v85.85,72.39
  VCC 0.813: v85.85,72.39 85.85,73.65 J10.P$1 J10.P$5
  Bottom 0.406: JP1.2 74.26,81.12 74.17,81.28 82.04,81.28 82.55,80.77 82.56,80.76 J10.P$5
RS485_B  (via drill 0.6)
  Top 0.406: D1.K 81.51,69.76 R2.1 R8.2
  Top 0.61: U11.7 84.85,67.76 D1.K
  Top 0.813: v82.3,72.39 82.3,70.54 D1.K
  Bottom 0.813: J10.P$6 J10.P$2 86.66,76.75 86.61,76.71 v82.3,72.39
RX2  (via drill 0.6)
  Top 0.305: U4.5 42.31,44.05 v42.8,43.43 | U6.4 18.4,20.97 18.16,21.21 18.16,24.13 20.45,26.42 22.35,26.42 | 22.35,26.42 29.72,26.42 v30.48,27.18 | R44.2 22.35,24.42 22.35,26.42
  Bottom 0.305: v42.8,43.43 42.8,42.67 44.45,41.02 44.96,41.02 45.47,40.51 45.47,36.2 46.99,34.67 46.99,29.08 45.59,27.69 30.99,27.69 v30.48,27.18
RX_OUT  (via drill 0.6)
  Top 0.305: U6.3 20.21,20.97 19.94,20.7 19.94,18.76 R24.2
  Top 0.406: v25.15,15.88 23.41,17.61 R24.2
  Bottom 0.406: JP3.2 32.26,6.35 30.99,7.62 27.56,7.62 26.67,8.51 26.67,14.35 v25.15,15.88
RXA  (via drill 0.6)
  Top 0.305: U4.32 33.45,35.9 32.38,36.96 32.38,37.85 v30.73,39.5 32.38,41.15 v32.38,48.9 | v47.62,54.99 R47.2
  VCC 0.305: v47.62,54.99 40.51,54.99 35.56,50.04 33.53,50.04 v32.38,48.9
  Bottom 0.305: v30.73,39.5 30.73,36.83 29.08,35.18 25.91,35.18 24,33.27 24,28.32 28.19,24.13 28.19,21.59 30.99,18.8 33.27,18.8 34.04,18.03 34.04,14.1 36.45,11.68 36.45,5.59 38.99,3.05 J13.P$6
SCL  (via drill 0.6)
  Top 0.305: U4.50 43.87,36.4 42.98,37.28 36.9,37.28 36.45,36.83 36.45,35.18 35.81,34.54 24.26,34.54 22.99,33.27 19.3,33.27 18.54,34.04 11.43,34.04 9.78,35.56 5.3,35.56 4.94,35.92
  Top 0.406: U3.6 3.77,61.68 6.86,64.77 R19.1 | v5.08,40.39 4.94,40.24 U5.6 4.94,35.92 3.3,34.29 3.3,29.43 J6.P$4
  Bottom 0.406: U3.6 4.36,61.68 5.08,60.96 v5.08,40.39
SDA  (via drill 0.6)
  Top 0.305: U4.51 44.26,36.9 43.43,37.72 43.37,37.78 36.64,37.78 35.94,37.08 35.94,35.43 35.69,35.18 24,35.18 22.73,33.91 19.68,33.91 18.92,34.67 11.56,34.67 10.41,35.81 10.41,38.35 v6.6,42.16
  Top 0.406: U3.5 3.77,64.22 4.57,65.02 R20.1 | v6.6,42.16 4.57,42.16 3.67,41.26 U5.5 3.67,35.67 2.54,34.54 2.54,28.45 3.81,27.18 5.08,27.18 6.96,29.06 J6.P$5
  Bottom 0.406: U3.5 4.87,64.22 7.37,61.72 7.37,42.93 v6.6,42.16
STAT1  (via drill 0.6)
  Top 0.305: T3.5 9.64,31.61 9.91,31.88 10.67,31.88 11.05,31.5 12.06,31.5 12.19,31.62 28.19,31.62 v28.7,32.13 | v38.35,35.56 37.81,35.02 U4.35
  Bottom 0.305: v28.7,32.13 28.83,32 36.96,32 37.72,32.77 37.72,34.92 v38.35,35.56
STAT2  (via drill 0.6)
  Top 0.305: 37.34,33.92 U4.34 37.31,36.42 v37.34,36.45 | T3.2 9.64,33.89 9.91,34.16 10.41,34.16 11.18,33.4 18.16,33.4 19.3,32.26 27.05,32.26 v27.81,33.02
  Bottom 0.305: v27.81,33.02 29.08,33.02 29.59,32.51 36.7,32.51 37.21,33.02 37.21,36.32 v37.34,36.45
SYS_5V  (via drill 0.6)
  Top 0.813: U1.P$7 U1.P$8 | J5.P$16 99.92,29.97 v87.63,29.97
  VCC 0.61: U1.P$8 63.03,19.05 71.63,19.05 76.71,24.13
  VCC 0.813: v87.63,29.97 86.11,28.45 86.11,25.4 84.84,24.13 76.71,24.13
TX2  (via drill 0.6)
  Top 0.305: U4.4 42.81,44.56 43.05,44.32 43.31,44.32 v44.07,43.56 | v30.48,25.65 24,25.65 23.37,25.02 23.37,22.48 | 23.37,22.48 23.37,20.57 22.46,19.67 U6.1 | 23.37,22.48 R43.2
  Bottom 0.305: v44.07,43.56 44.07,42.16 44.7,41.53 45.21,41.53 45.97,40.77 45.97,36.45 47.62,34.92 47.62,28.96 45.85,27.18 32,27.18 v30.48,25.65
TX_OUT  (via drill 0.6)
  Top 0.305: R25.2 18.92,18.03 18.16,18.8 18.16,19.3 18.53,19.67 U6.6
  Top 0.406: R25.2 20.07,16.47 v20.07,14.73
  Bottom 0.406: v20.07,14.73 20.95,15.62 23.88,15.62 25.78,13.72 25.78,8 27.43,6.35 JP2.1
TXA  (via drill 0.6)
  Top 0.305: U4.31 33.71,36.4 33.02,37.08 33.02,38.48 v32,39.5 33.02,40.51 33.02,47.24 34.92,49.15 v40.89,49.15 | v46.86,49.28 46.61,49.02 R40.2
  VCC 0.305: v40.89,49.15 46.74,49.15 v46.86,49.28
  Bottom 0.305: v32,39.5 32,37.34 29.21,34.54 26.16,34.54 24.64,33.02 24.64,28.57 28.83,24.38 28.83,21.84 31.24,19.43 33.53,19.43 34.67,18.29 34.67,14.35 37.08,11.94 37.08,7.49 38.99,5.59 J13.P$4
UART1_RXD  (via drill 0.6)
  Top 0.406: U10.12 69.99,23 v69.85,22.86
  Bottom 0.406: U1.P$26 38.84,20.35 40.13,19.05 40.13,17.27 43.18,14.22 68.83,14.22 71.37,16.76 71.37,21.08 69.85,22.61 v69.85,22.86
UART1_TXD  (via drill 0.6)
  Top 0.406: U10.11 68.72,23 v68.58,22.86
  Bottom 0.406: U1.P$24 41.59,20.39 42.67,19.3 42.67,17.27 44.96,14.99 68.58,14.99 70.61,17.02 70.61,20.83 v68.58,22.86
UART2_RXD  (via drill 0.6)
  Top 0.406: U10.9 66.18,23 v66.04,22.86
  Bottom 0.406: U1.P$22 44.13,20.39 45.21,19.3 45.21,17.27 45.97,16.51 64.77,16.51 65.53,17.27 65.53,21.34 v66.04,22.86
UART2_TXD  (via drill 0.6)
  Top 0.406: U10.10 67.45,23 v67.31,22.86
  Bottom 0.406: U1.P$21 43.91,17.55 45.72,15.75 66.55,15.75 68.07,17.27 68.07,21.84 v67.31,22.86
UART4_RTS  (via drill 0.6)
  Top 0.406: U11.3 U11.2 84.84,59.49 84.84,61.47 84.45,61.85 v81.53,61.85 R10.1
  Bottom 0.406: U1.P$79 41.59,66.11 47.5,60.2 79.88,60.2 v81.53,61.85
UART4_RXD  (via drill 0.6)
  Top 0.406: U11.1 83.58,57.8 82.68,56.9 71.25,56.9 69.72,58.42 66.8,58.42 65.79,57.4 v65.79,38.1
  VCC 0.406: U1.P$11 56.57,17.85 55.37,19.05 55.37,22.1 56.9,23.62 58.42,23.62 60.45,25.65 60.45,36.07 62.48,38.1 v65.79,38.1
UART4_TXD  (via drill 0.6)
  Top 0.406: U11.4 87.39,56.53 86.87,56.01 69.22,56.01 66.55,53.34 66.55,39.37 v66.8,39.12
  VCC 0.406: v66.8,39.12 62.48,39.12 59.69,36.32 59.69,25.91 58.17,24.38 56.13,24.38 52.83,21.08 52.83,19.09 U1.P$13
UART5_RXD  (via drill 0.6)
  Top 0.406: U1.P$84 23.59,68.61 24.89,67.31 24.89,42.42 23.75,41.27 22.61,41.27 v21.08,39.75 | v28.83,19.43 30.63,19.43 U2.6
  Bottom 0.406: v21.08,39.75 21.08,28.19 27.3,21.97 27.3,20.19 28.07,19.43 v28.83,19.43
UART5_TXD  (via drill 0.6)
  Top 0.406: U1.P$83 23.59,66.07 24.13,65.53 24.13,42.93 23.37,42.16 22.23,42.16 v19.81,39.75 | v33.02,17.53 32.85,17.69 U2.3
  Bottom 0.406: v19.81,39.75 19.81,28.19 26.54,21.46 26.54,18.92 27.69,17.78 32.77,17.78 v33.02,17.53
V+  (via drill 0.6)
  Top 0.305: C8.1 64.6,22.57 64.6,22.56 | U2.5 31.37,18.8 31.62,18.54 32.64,18.54
  Top 0.406: R9.2 88.08,67.62 88.65,67.06 88.65,64.26 87.38,62.99 83.57,62.99 | 65.29,63.64 65.42,68.83 | 65.42,68.83 65.42,70.31 R1.1 | C1.2 81.8,63.5 82.3,63.01 | C2.1 64.22,68.83 65.42,68.83 | R15.2 87,14.99 85.72,13.72 70.91,13.72 U1.P$3 65.44,16.51 60.96,16.51 60.45,17.02 60.45,18.54 59.82,19.18 37.85,19.18 37.21,18.54 32.64,18.54 | R37.1 62.55,35.12 v62.74,35.31 | R17.2 R16.2 84.24,26.84 v84.33,26.92 | C9.1 75.44,22.67 75.44,23.37 75.01,23.8 75.01,24.64 U10.16 75.5,24.7 v76.2,25.4
  Top 0.61: 64.52,36.58 v64.64,35.31 65.15,34.8 76.07,34.8 80.14,30.86 v80.14,29.34
  Top 0.813: 83.58,63.01 U11.8 | 83.58,63.01 83.57,62.99 | 83.58,63.01 82.3,63.01 70.22,63.01 69.6,63.63 65.29,63.64 64.52,62.87 64.52,36.58 64.52,22.65 64.6,22.56 U1.P$4 U1.P$3
  VCC 0.406: v64.64,35.31 v62.74,35.31 | v84.33,26.92 82.55,26.92 v80.14,29.34
  VCC 0.61: v80.14,29.34 v76.2,25.4
VCAP
  Top 0.305: C18.+ 39.37,47.37 39.81,46.93 U4.10
VDD_5V  (via drill 0.6)
  Top 0.406: Q1.4 60.47,29.25 R36.1
  Top 0.61: Q1.4 62.19,30.78 v62.23,30.73
  Top 1.016: C26.1 99.28,62.57 U8.P$3 | U1.P$5 U1.P$6
  Top 1.27: U8.P$3 99.28,63.05 C23.+ C24.+ C25.+
  Top 1.422: C25.+ 98.47,54.69 v98.55,54.61
  VCC 1.016: v62.23,30.73 71.88,30.73 72.01,30.86
  VCC 1.422: U1.P$6 64.26,20.42 64.26,23.11 72.01,30.86 77.34,30.86 81.79,35.31 92.46,35.31 93.6,36.45 93.6,49.66 v98.55,54.61
(copper drawn outside any net)
  shapes: Bottom circle x1